# EAGLE design sega-genesis-forever (EAGLE 7.7.0)
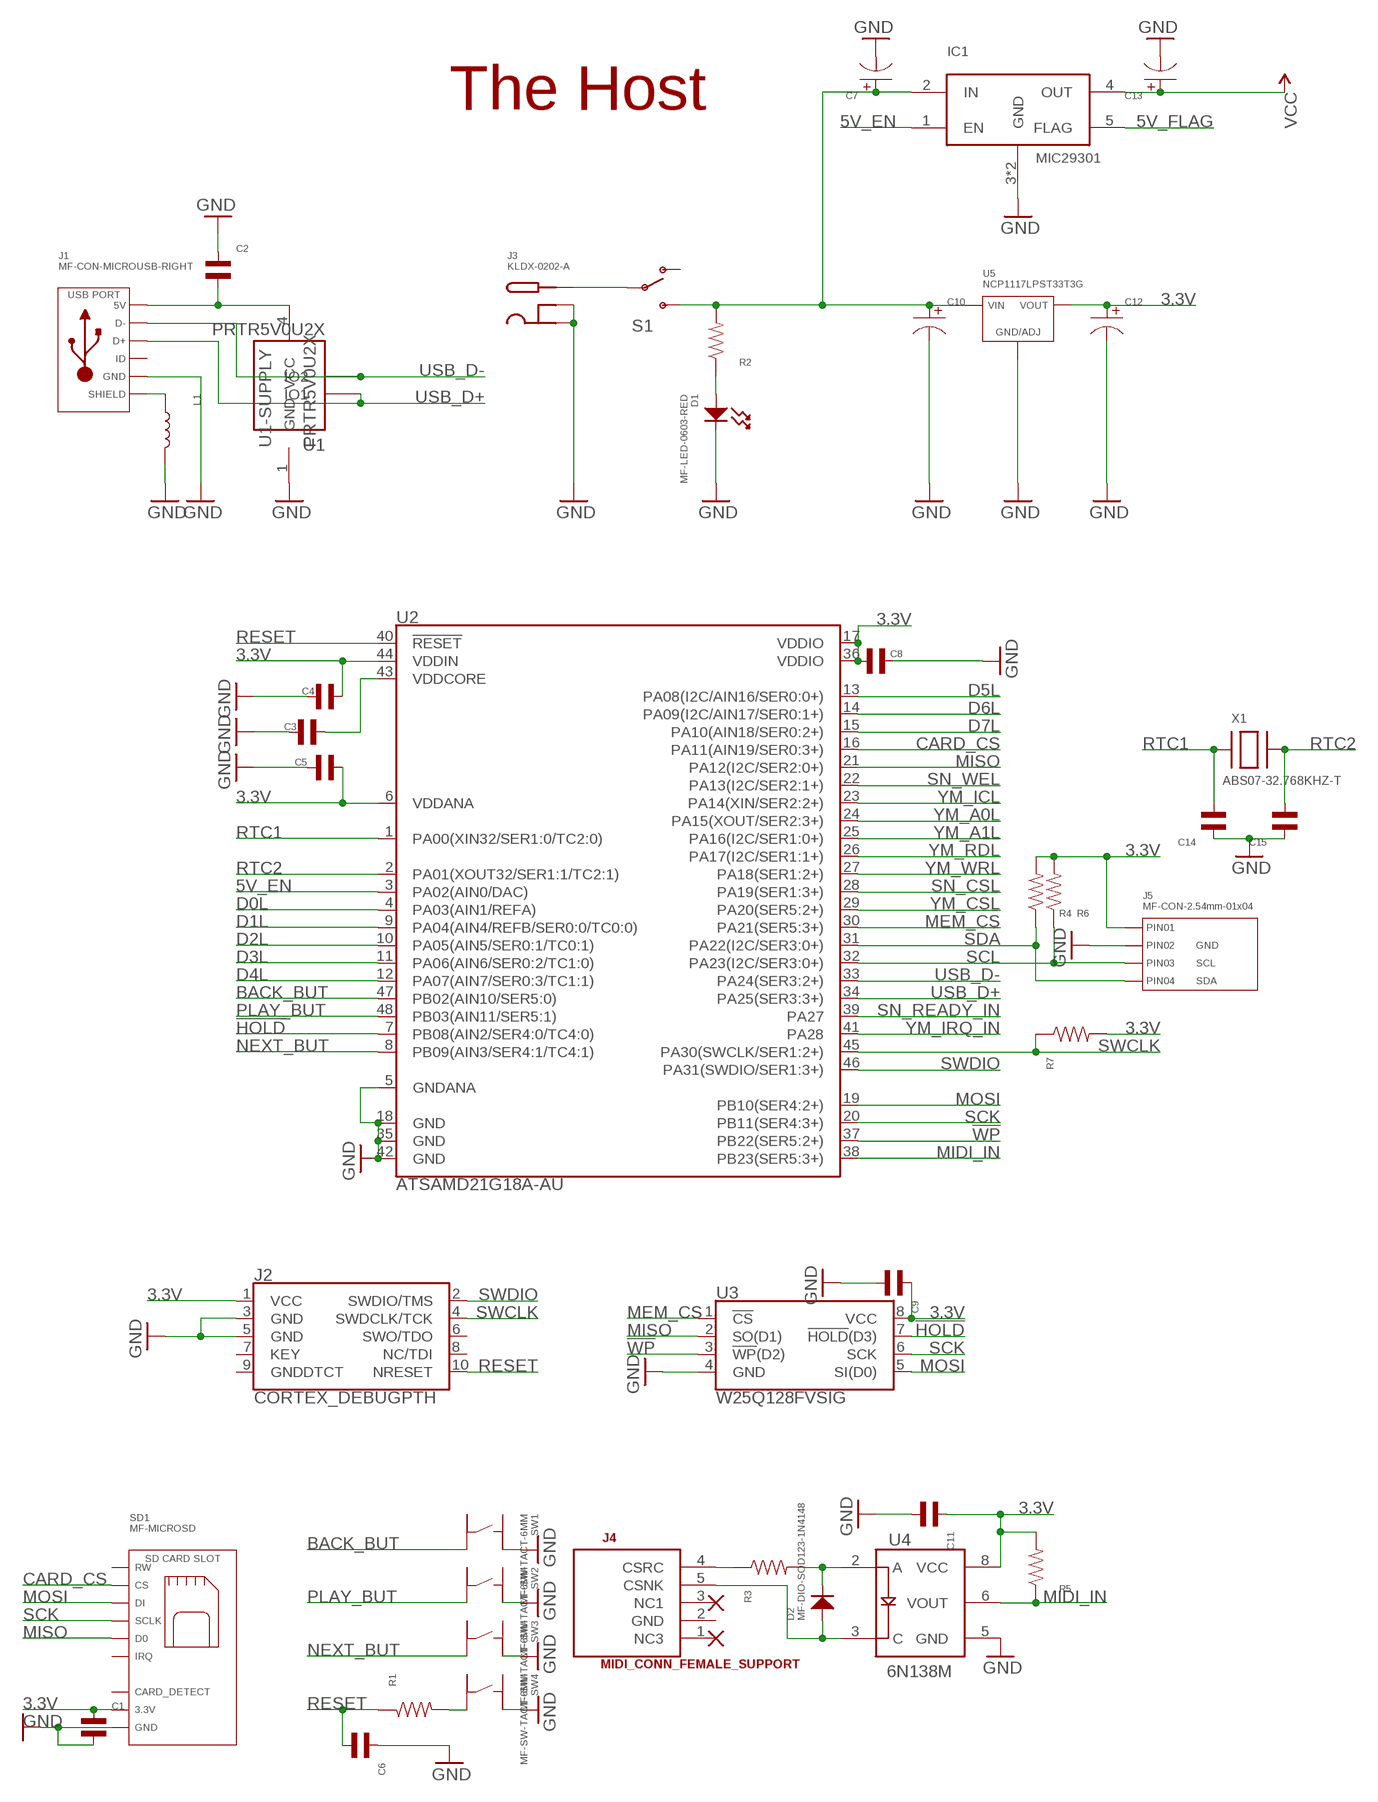
[diagram p0: schematic, sheet 1, part 1 of 2]
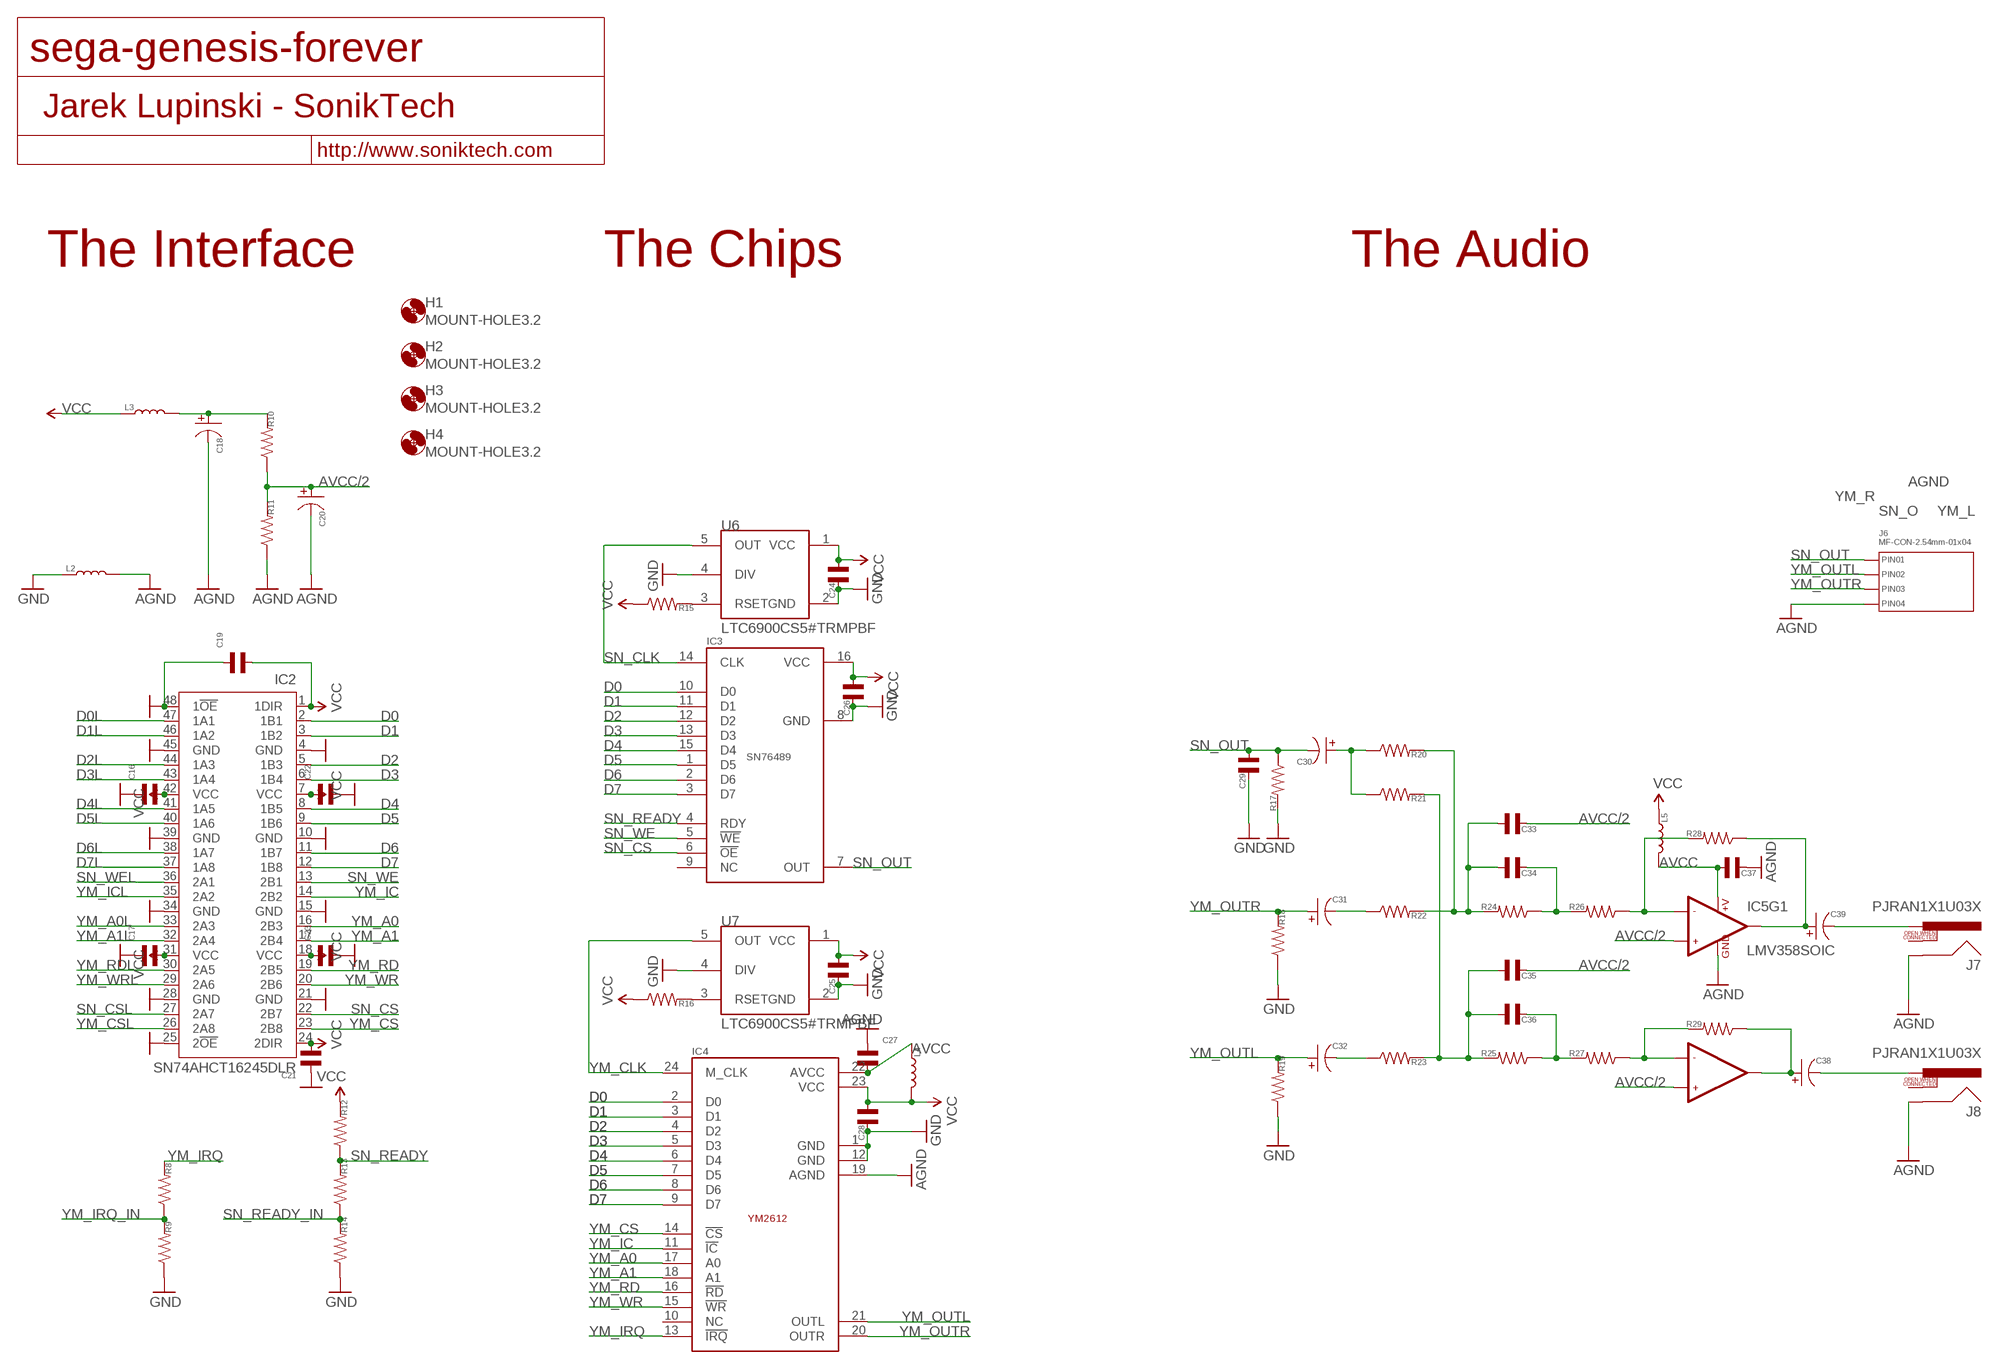
[diagram p1: schematic, sheet 1, part 2 of 2]

## Parts
C1  CAPACITOR_NP_0603  [C0603]
C2  CAPACITOR_NP_0603  [C0603]
C3  CAPACITOR_NP_0603  [C0603]
C4  CAPACITOR_NP_0603  [C0603]
C5  CAPACITOR_NP_0603  [C0603]
C6  CAPACITOR_NP_0603  [C0603]
C7  CAPACITOR_P_4MM  [CP4MM]
C8  CAPACITOR_NP_0603  [C0603]
C9  CAPACITOR_NP_0603  [C0603]
C10  CAPACITOR_P_4MM  [CP4MM]
C11  CAPACITOR_NP_0603  [C0603]
C12  CAPACITOR_P_4MM  [CP4MM]
C13  CAPACITOR_P_4MM  [CP4MM]
C14  CAPACITOR_NP_0603  [C0603]
C15  CAPACITOR_NP_0603  [C0603]
C16  CAPACITOR_NP_0603  [C0603]
C17  CAPACITOR_NP_0603  [C0603]
C18  CAPACITOR_P_4MM  [CP4MM]
C19  CAPACITOR_NP_0603  [C0603]
C20  CAPACITOR_P_6.3MM  [CP6.3MM]
C21  CAPACITOR_NP_0603  [C0603]
C22  CAPACITOR_NP_0603  [C0603]
C23  CAPACITOR_NP_0603  [C0603]
C24  CAPACITOR_NP_0603  [C0603]
C25  CAPACITOR_NP_0603  [C0603]
C26  CAPACITOR_NP_0603  [C0603]
C27  CAPACITOR_NP_0603  [C0603]
C28  CAPACITOR_NP_0603  [C0603]
C29  CAPACITOR_NP_0603  [C0603]
C30  CAPACITOR_P_4MM  [CP4MM]
C31  CAPACITOR_P_4MM  [CP4MM]
C32  CAPACITOR_P_4MM  [CP4MM]
C33  CAPACITOR_NP_0603  [C0603]
C34  CAPACITOR_NP_0603  [C0603]
C35  CAPACITOR_NP_0603  [C0603]
C36  CAPACITOR_NP_0603  [C0603]
C37  CAPACITOR_NP_0603  [C0603]
C38  CAPACITOR_P_4MM  [CP4MM]
C39  CAPACITOR_P_4MM  [CP4MM]
D1  MF-LED-0603-RED  LED_SINGLE-0603-RED  [LED0603]
D2  MF-DIO-SOD123-1N4148  DIODES_1N4148_SOD-123  [SOD-123]
H1  MOUNT-HOLE3.2  [3,2]
H2  MOUNT-HOLE3.2  [3,2]
H3  MOUNT-HOLE3.2  [3,2]
H4  MOUNT-HOLE3.2  [3,2]
IC1  MIC29301  [TO263-5]
IC2  SN74AHCT16245DLR  SN74LVCR162245A  [DL_R-PDSO-G48]
IC3  ED16DT  SN76489  [DIL16-EZ]
IC4  ED24DT  YM2612  [DIL24-EZ]
IC5  LMV358SOIC  [SO08]
J1  MF-CON-MICROUSB-RIGHT  USB_MICRO_RIGHT  [MICROUSB-RIGHT]
J2  CORTEX_DEBUGPTH  [2X5-PTH-1.27MM]
J3  KLDX-0202-A  DC_PWR_JACK_2.0MM_RIGHT  [DC_PWR_JACK]
J4  MIDI_CONN_FEMALE_SUPPORT  [DIN_5_FEMALE_SUPPORT]
J5  MF-CON-2.54mm-01x04  CON_01X04_PTH_2.54MM  [PTH_2.54MM_01X04]
J6  MF-CON-2.54mm-01x04  CON_01X04_PTH_2.54MM  [PTH_2.54MM_01X04]
J7  PJRAN1X1U03X  RCA  [RCA]
J8  PJRAN1X1U03X  RCA  [RCA]
L1  INDUCTOR_1210  [L1210]
L2  INDUCTOR_0603  [L0603]
L3  INDUCTOR_0603  [L0603]
L4  INDUCTOR_0603  [L0603]
L5  INDUCTOR_0603  [L0603]
R1  RESISTOR_0603  [R0603]
R2  RESISTOR_0603  [R0603]
R3  RESISTOR_0603  [R0603]
R4  RESISTOR_0603  [R0603]
R5  RESISTOR_0603  [R0603]
R6  RESISTOR_0603  [R0603]
R7  RESISTOR_0603  [R0603]
R8  RESISTOR_0603  [R0603]
R9  RESISTOR_0603  [R0603]
R10  RESISTOR_0603  [R0603]
R11  RESISTOR_0603  [R0603]
R12  RESISTOR_0603  [R0603]
R13  RESISTOR_0603  [R0603]
R14  RESISTOR_0603  [R0603]
R15  RESISTOR_0603  [R0603]
R16  RESISTOR_0603  [R0603]
R17  RESISTOR_0603  [R0603]
R18  RESISTOR_0603  [R0603]
R19  RESISTOR_0603  [R0603]
R20  RESISTOR_0603  [R0603]
R21  RESISTOR_0603  [R0603]
R22  RESISTOR_0603  [R0603]
R23  RESISTOR_0603  [R0603]
R24  RESISTOR_0603  [R0603]
R25  RESISTOR_0603  [R0603]
R26  RESISTOR_0603  [R0603]
R27  RESISTOR_0603  [R0603]
R28  RESISTOR_0603  [R0603]
R29  RESISTOR_0603  [R0603]
S1  SWITCH-SPDTPTH  [SWITCH-SPDT]
SD1  MF-MICROSD  SD_CARD_SLOT_MICRO_RIGHT  [MF-MICROSD]
SW1  MF-SW-TACT-6MM  TACT_6MM  [TACT6MM]
SW2  MF-SW-TACT-6MM  TACT_6MM  [TACT6MM]
SW3  MF-SW-TACT-6MM  TACT_6MM  [TACT6MM]
SW4  MF-SW-TACT-6MM  TACT_6MM  [TACT6MM]
U1  PRTR5V0U2X  [SOT-143B]
U2  ATSAMD21G18A-AU  ATSAMD21G-A  [TQFP-48]
U3  W25Q128FVSIG  W25Q32FVSS  [SOIC-8]
U4  6N138M  OPTO_DARL_6N138S  [8-SMD]
U5  NCP1117LPST33T3G  [SOT-223-3]
U6  LTC6900CS5#TRMPBF  LTC6900  [TSOT23-5L]
U7  LTC6900CS5#TRMPBF  LTC6900  [TSOT23-5L]
X1  ABS07-32.768KHZ-T  XTAL-3.2X1.5  [XTAL3215]

## Nets
3.3V: C1.P$1 C4.P$2 C5.P$2 C8.P$2 C9.P$1 C11.P$1 C12.P$1 J2.1(VCC) J5.P$1(PIN1) R4.P$2 R5.P$2 R6.P$2 R7.P$2 SD1.PIN4(3.3V) U2.6(VDDANA) U2.17(VDDIO) U2.36(VDDIO) U2.44(VDDIN) U3.8(VCC) U4.8(VCC) U5.P$1(VOUT) U5.P$3(VOUT)
5V_EN: IC1.1(EN) U2.3(PA02(AIN0/DAC))
5V_FLAG: IC1.5(FLAG)
!HOLD: U2.7(PB08(AIN2/SER4:0/TC4:0)) U3.7(!HOLD!(D3))
!WP: U2.37(PB22(SER5:2+)) U3.3(!WP!(D2))
AGND [Power]: C18.P$2 C20.P$2 C27.P$1 C37.P$2 IC4.19(AGND) IC5.4(GND) J6.P$4(PIN4) J7.SHELL J8.SHELL L2.P$2 R11.P$1
AVCC [Power]: C27.P$2 C37.P$1 IC4.22(AVCC) IC5.8(+V) L4.P$1 L5.P$2
AVCC/2 [Power]: C20.P$1 C33.P$2 C35.P$2 IC5.3(+IN1) IC5.5(+IN2) R10.P$1 R11.P$2
BACK_BUT: SW1.P$4 U2.47(PB02(AIN10/SER5:0))
CARD_CS: SD1.PIN2(CS) U2.16(PA11(AIN19/SER0:3+))
D0: IC2.2(1B1) IC3.10(D0) IC4.2(D0)
D0L: IC2.47(1A1) U2.4(PA03(AIN1/REFA))
D1: IC2.3(1B2) IC3.11(D1) IC4.3(D1)
D1L: IC2.46(1A2) U2.9(PA04(AIN4/REFB/SER0:0/TC0:0))
D2: IC2.5(1B3) IC3.12(D2) IC4.4(D2)
D2L: IC2.44(1A3) U2.10(PA05(AIN5/SER0:1/TC0:1))
D3: IC2.6(1B4) IC3.13(D3) IC4.5(D3)
D3L: IC2.43(1A4) U2.11(PA06(AIN6/SER0:2/TC1:0))
D4: IC2.8(1B5) IC3.15(D4) IC4.6(D4)
D4L: IC2.41(1A5) U2.12(PA07(AIN7/SER0:3/TC1:1))
D5: IC2.9(1B6) IC3.1(D5) IC4.7(D5)
D5L: IC2.40(1A6) U2.13(PA08(I2C/AIN16/SER0:0+))
D6: IC2.11(1B7) IC3.2(D6) IC4.8(D6)
D6L: IC2.38(1A7) U2.14(PA09(I2C/AIN17/SER0:1+))
D7: IC2.12(1B8) IC3.3(D7) IC4.9(D7)
D7L: IC2.37(1A8) U2.15(PA10(AIN18/SER0:2+))
GND [Power]: C1.P$2 C2.P$1 C3.P$2 C4.P$1 C5.P$1 C6.P$1 C7.P$2 C8.P$1 C9.P$2 C10.P$2 C11.P$2 C12.P$2 C13.P$2 C14.P$1 C15.P$1 C16.P$1 C17.P$1 C19.P$1 C21.P$1 C22.P$2 C23.P$2 C24.P$2 C25.P$2 C26.P$2 C28.P$2 C29.P$2 D1.CATHODE IC1.3(GND) IC1.6(GND) IC2.4(GND) IC2.10(GND) IC2.15(GND) IC2.21(GND) IC2.25(2!OE) IC2.28(GND) IC2.34(GND) IC2.39(GND) IC2.45(GND) IC2.48(1!OE) IC3.8(GND) IC4.1(GND) IC4.12(GND) J1.5(GND) J2.3(GND) J2.5(GND) J3.SLEEVE1(SLEEVE) J3.SLEEVE2(SLEEVE_SHUNT) J5.P$2(PIN2) L1.P$2 L2.P$1 R9.P$1 R14.P$1 R17.P$2 R18.P$1 R19.P$1 SD1.G0(GND) SD1.G1(GND) SD1.PIN6(GND) SW1.P$2 SW2.P$2 SW3.P$2 SW4.P$2 U1.1(GND) U2.5(GNDANA) U2.18(GND) U2.35(GND) U2.42(GND) U3.4(GND) U4.5(GND) U5.P$2(GND/ADJ) U6.2(GND) U6.4(DIV) U7.2(GND) U7.4(DIV)
LADC: IC5.6(-IN2) R27.P$1 R29.P$2
MEM_CS: U2.30(PA21(SER5:3+)) U3.1(!CS!)
MIDI_IN: R5.P$1 U2.38(PB23(SER5:3+)) U4.6(VOUT)
MISO: SD1.PIN7(D0) U2.21(PA12(I2C/SER2:0+)) U3.2(SO(D1))
MOSI: SD1.PIN3(DI) U2.19(PB10(SER4:2+)) U3.5(SI(D0))
N$1: C30.P$1 R20.P$1 R21.P$1
N$2: C31.P$2 R22.P$1
N$3: C32.P$2 R23.P$1
N$4: C33.P$1 C34.P$1 R20.P$2 R22.P$2 R24.P$2
N$5: C35.P$1 C36.P$1 R21.P$2 R23.P$2 R25.P$2
N$6: C39.P$1 IC5.1(OUT1) R28.P$1
N$7: J4.4(CSRC) R3.P$1
N$8: C3.P$1 U2.43(VDDCORE)
N$9: R1.P$2 SW4.P$4
N$10: J1.S1(SLD) J1.S2(SLD) J1.S3(SLD) J1.S4(SLD) J1.S5(SLD) J1.S6(SLD) L1.P$1
N$11: C38.P$1 IC5.7(OUT2) R29.P$1
N$12: C34.P$2 R24.P$1 R26.P$2
N$13: D2.CATHODE R3.P$2 U4.2(A)
N$14: D2.ANODE J4.5(CSNK) U4.3(C)
N$16: C39.P$2 J7.PIN
N$17: C36.P$2 R25.P$1 R27.P$2
N$18: D1.ANODE R2.P$1
N$19: C18.P$1 L3.P$2 R10.P$2
N$20: C38.P$2 J8.PIN
N$21 [Power]: C7.P$1 C10.P$1 IC1.2(IN) R2.P$2 S1.3(S) U5.P$4(VIN)
N$22 [Power]: J3.PIN S1.2(P)
N$23: R16.P$2 U7.3(RSET)
N$24: R15.P$2 U6.3(RSET)
N$25: C2.P$2 J1.1(5V) U1.4(VCC)
NEXT_BUT: SW3.P$4 U2.8(PB09(AIN3/SER4:1/TC4:1))
PLAY_BUT: SW2.P$4 U2.48(PB03(AIN11/SER5:1))
RADC: IC5.2(-IN1) R26.P$1 R28.P$2
RESET: C6.P$2 J2.10(NRESET) R1.P$1 U2.40(!RESET!)
RTC1: C14.P$2 U2.1(PA00(XIN32/SER1:0/TC2:0)) X1.P$1
RTC2: C15.P$2 U2.2(PA01(XOUT32/SER1:1/TC2:1)) X1.P$2
SCK: SD1.PIN5(SCLK) U2.20(PB11(SER4:3+)) U3.6(SCK)
SCL: J5.P$3(PIN3) R6.P$1 U2.32(PA23(I2C/SER3:0+))
SDA: J5.P$4(PIN4) R4.P$1 U2.31(PA22(I2C/SER3:0+))
SN_CLK: IC3.14(CLK) U6.5(OUT)
SN_CS: IC2.22(2B7) IC3.6(!OE)
SN_CSL: IC2.27(2A7) U2.28(PA19(SER1:3+))
SN_OUT: C29.P$1 C30.P$2 IC3.7(OUT) J6.P$1(PIN1) R17.P$1
SN_READY: IC3.4(RDY) R12.P$1 R13.P$2
SN_READY_IN: R13.P$1 R14.P$2 U2.39(PA27)
SN_WE: IC2.13(2B1) IC3.5(!WE)
SN_WEL: IC2.36(2A1) U2.22(PA13(I2C/SER2:1+))
SWCLK: J2.4(SWDCLK/TCK) R7.P$1 U2.45(PA30(SWCLK/SER1:2+))
SWDIO: J2.2(SWDIO/TMS) U2.46(PA31(SWDIO/SER1:3+))
USB_D+: J1.3(D+) U1.2(IO1) U2.34(PA25(SER3:3+))
USB_D-: J1.2(D-) U1.3(IO2) U2.33(PA24(SER3:2+))
VCC [Power]: C13.P$1 C16.P$2 C17.P$2 C19.P$2 C21.P$2 C22.P$1 C23.P$1 C24.P$1 C25.P$1 C26.P$1 C28.P$1 IC1.4(OUT) IC2.1(1DIR) IC2.7(VCC) IC2.18(VCC) IC2.24(2DIR) IC2.31(VCC) IC2.42(VCC) IC3.16(VCC) IC4.23(VCC) L3.P$1 L4.P$2 L5.P$1 R12.P$2 R15.P$1 R16.P$1 U6.1(VCC) U7.1(VCC)
YM_A0: IC2.16(2B3) IC4.17(A0)
YM_A0L: IC2.33(2A3) U2.24(PA15(XOUT/SER2:3+))
YM_A1: IC2.17(2B4) IC4.18(A1)
YM_A1L: IC2.32(2A4) U2.25(PA16(I2C/SER1:0+))
YM_CLK: IC4.24(M_CLK) U7.5(OUT)
YM_CS: IC2.23(2B8) IC4.14(!CS)
YM_CSL: IC2.26(2A8) U2.29(PA20(SER5:2+))
YM_IC: IC2.14(2B2) IC4.11(!IC)
YM_ICL: IC2.35(2A2) U2.23(PA14(XIN/SER2:2+))
YM_IRQ: IC4.13(!IRQ) R8.P$2
YM_IRQ_IN: R8.P$1 R9.P$2 U2.41(PA28)
YM_OUTL: C32.P$1 IC4.21(OUTL) J6.P$2(PIN2) R19.P$2
YM_OUTR: C31.P$1 IC4.20(OUTR) J6.P$3(PIN3) R18.P$2
YM_RD: IC2.19(2B5) IC4.16(!RD)
YM_RDL: IC2.30(2A5) U2.26(PA17(I2C/SER1:1+))
YM_WR: IC2.20(2B6) IC4.15(!WR)
YM_WRL: IC2.29(2A6) U2.27(PA18(SER1:2+))
Unconnected: IC3.9(NC) IC4.10(NC) J1.4(ID) J2.6(SWO/TDO) J2.7(KEY) J2.8(NC/TDI) J2.9(GNDDTCT) J4.1(NC3) J4.2(GND) J4.3(NC1) J7.SWITCH J8.SWITCH S1.1(O) SD1.PIN1(RW) SD1.PIN8(IRQ) SD1.PIN9(CRD_DTCT) SD1.PIN10(CRD_DTCT) SW1.P$1 SW1.P$3 SW2.P$1 SW2.P$3 SW3.P$1 SW3.P$3 SW4.P$1 SW4.P$3

## Notes on the sheet
- The Host
- The Interface | The Chips | The Audio

## Library data of the parts
C1-C6 C8 C9 C11 C14-C17 C19 C21-C29 C33-C37 = MF_Passives:CAPACITOR_NP: Library: MF_Passives Description: Device for Non-Polarized Capacitors. Manufacture part number (MPN) can be added via Attributes. Check https://factory.macrofab.com/parts for the house parts list.; POPULATE: 1
C7 C10 C12 C13 C18 C20 C30-C32 C38 C39 = MF_Passives:CAPACITOR_P: Library: MF_Passives Description: Device for Polarized Capacitors. Manufacture part number (MPN), Voltage Rating, and Tolerance can be added via Attributes. Check https://factory.macrofab.com/parts for the house parts list.; POPULATE: 1
D1 = MF_LEDs:LED_SINGLE: Library: MF_LEDs Description: Device for Single LED Packages. Manufacture part number (MFG#) can be added via Attributes.; HOUSEPART: YES; MPN: MF-LED-0603-RED; POPULATE: 1; URL: https://factory.macrofab.com/part/MF-LED-0603-RED
D2 = MF_Discrete_Semiconductor:DIODES: Library: MF_Discrete_Semiconductor Description: Device for Single Packaged Diodes.; HOUSEPART: YES; MPN: MF-DIO-SOD123-1N4148; POPULATE: 1; URL: https://factory.macrofab.com/part/MF-DIO-SOD123-1N4148
H1-H4 = holes:MOUNT-HOLE: MOUNTING HOLE with drill center marker
IC1 = sonik:MIC29301
IC2 = texas:SN74LVCR162245A: 16-BIT BUS TRANSCEIVER WITH 3-STATE OUTPUTS Auto generated by make-symbol-device-package-bsdl.ulp Rev. 33 Source: http://focus.ti.com/lit/ds/symlink/sn74lvcr162245.pdf; MPN: SN74LVCR162245DL; OC_FARNELL: 1739707; OC_NEWARK: 50R6613
IC3 = sonik:SN76489
IC4 = sonik:YM2612
IC5 = SparkFun-AnalogIC:LMV358: Jellybean rail-to-rail output op-amp; PROD_ID: IC-09657
J1 = MF_Connectors:USB: Library: MF_Connectors Description: 5 Pin USB Connectors. SLD is the shield connection. Usually tied to ground through a small ferrite bead.; HOUSEPART: YES; MPN: MF-CON-MICROUSB-RIGHT; POPULATE: 1; URL: https://factory.macrofab.com/part/MF-CON-MICROUSB-RIGHT
J2 = SparkFun-Connectors:CORTEX_DEBUG: Cortex Debug Connector Datasheet <http://infocenter.arm.com/help/topic/com.arm.doc.faqs/attached/13634/cortex_debug_connectors.pdf>
J3 = MF_Connectors:DC_PWR_JACK: Library: MF_Connectors Description: DC Barrel Power Jack Connector.; HOUSEPART: NO; MPN: KLDX-0202-A; POPULATE: 1; URL: http://www.4uconnector.com/online/object/4udrawing/18741.pdf
J4 = SparkFun-Connectors:MIDI_CONN_FEMALE_SUPPORT: MIDI connector with strain relief (DIN-5 female)
J5 = MF_Connectors:CON_01X04: Library: MF_Connectors Description: Header Connector with 04 Positions and 01 Rows. Use the LABEL Attribute to label the pin on the schematic and PCB. You can remove the attributes on the PCB by using the SMASH function on the part and then deleting the text.; HOUSEPART: YES; LABEL01: 3.3V; LABEL02: GND; LABEL03: SCL; LABEL04: SDA; MPN: MF-CON-2.54mm-01x04; POPULATE: 1; URL: https://factory.macrofab.com/part/MF-CON-2.54mm-01x04
J6 = MF_Connectors:CON_01X04: Library: MF_Connectors Description: Header Connector with 04 Positions and 01 Rows. Use the LABEL Attribute to label the pin on the schematic and PCB. You can remove the attributes on the PCB by using the SMASH function on the part and then deleting the text.; HOUSEPART: YES; LABEL01: SN_O; LABEL02: YM_L; LABEL03: YM_R; LABEL04: AGND; MPN: MF-CON-2.54mm-01x04; POPULATE: 1; URL: https://factory.macrofab.com/part/MF-CON-2.54mm-01x04
J7 J8 = SparkFun-Connectors:RCA
L1 = MF_Passives:INDUCTOR: Library: MF_Passives Description: Device for Inductors. Manufacture part number (MPN) can be added via Attributes. Check https://factory.macrofab.com/parts for the house parts list.
L2-L5 = MF_Passives:INDUCTOR: Library: MF_Passives Description: Device for Inductors. Manufacture part number (MPN) can be added via Attributes. Check https://factory.macrofab.com/parts for the house parts list.; POPULATE: 1
R1-R29 = MF_Passives:RESISTOR: Library: MF_Passives Description: Device for Resistors. Manufacture part number (MPN), Voltage, Tolerance, and Wattage Rating can be added via Attributes. Check https://factory.macrofab.com/parts for the house parts list.; POPULATE: 1
S1 = SparkFun-Electromechanical:SWITCH-SPDT: SPDT Switch Simple slide switch, Spark Fun Electronics SKU : COM-00102 DPDT SMT slide switch, AYZ0202, SWCH-08179; PROD_ID: SWCH-08261
SD1 = MF_Connectors:SD_CARD_SLOT: Library: MF_Connectors Description: SD Card Connector; HOUSEPART: YES; MPN: MF-MICROSD; POPULATE: 1; URL: https://factory.macrofab.com/part/MF-MICROSD
SW1-SW4 = MF_Switches:TACT: Library: MF_Switches Description: Device for Tact Switches. Manufacture part number (MFG#) can be added via Attributes.; HOUSEPART: YES; MPN: MF-SW-TACT-6MM; POPULATE: 1; URL: https://factory.macrofab.com/part/MF-SW-TACT-6MM
U1 = Volks73-NXPSemiconductors:PRTR5V0U2X?: I2C-Bus EDS Protection Ulta low capacitance double rail-to-rail ESD protection diode Documentation Datasheet <http://www.nxp.com/documents/data_sheet/PRTR5V0U2X.pdf> General Description Ultra low capacitance rail-to-rail ElectroStatic Discharge (ESD) protection diode in a small SOT143B Surface-Mounted Device (SMD) plastic package designed to protect two Hi-Speed data lines or high-frequency signal lines from the damage caused by ESD and other transients. PRTR5V0U2X incorporates two pairs of ultra low capacitance rail-to-rail diodes as well as an additional ESD protection diode to ensure signal line protection even if no supply voltage is available. Features ESD protection of two Hi-Speed data lines or high-frequency signal lines Ultra low input/output to ground capacitance: C(I/O-GND) = 1 pF ESD protection up to 8kV IEC 61000-4-2, level 4 (ESD) Very low clamping voltage due to an integrated additional ESD protection diode Very low reverse current Small SMD plastic package Applications USB 2.0 ports Digital Video Interface (DVI)/High Definition Multimedia Interface (HDMI) interfaces Mobile and cordless phones Personal Digital Assistants (PDA) Digital Cameras Wide Area Network (WAN) / Local Area Network (LAN) systems PCs, notebooks, printers, and other PC peripherals; APPLICATIONS: General Purpose; BIDIRECTIONAL_CHANNELS: 2; CAPACITANCE: 1pF @ 1MHz; CURRENT_PEAK_PULSE: -; DESCRIPTION: TVS DIODE 5.5VWM SOT143B; DOCUMENTATION_LINK: <a href="http://www.nxp.com/documents/data_sheet/PRTR5V0U2X.pdf">Datasheet</a>; DOCUMENTATION_URL: http://www.nxp.com/documents/data_sheet/PRTR5V0U2X.pdf; MANUFACTURER: NXP Semiconductors; MOUNTING_TYPE: Surface Mount; OPERATING_TEMPERATURE: -40C ~ 85C; PART_NUMBER: PRTR5V0U2X,215; POWER-PEAK_PULSE: -; POWER_LINE_PROTECTION: Yes; SUPPLIER_ITEM_LINK: <a href="http://www.digikey.com/product-detail/en/PRTR5V0U2X,215/568-4140-1-ND/1589981">Details</a>; SUPPLIER_ITEM_NUMBER: 568-4140-1-ND; SUPPLIER_ITEM_URL: http://www.digikey.com/product-detail/en/PRTR5V0U2X,215/568-4140-1-ND/1589981; SUPPLIER_LINK: <a href="http://www.digikey.com">Home Page</a>; SUPPLIER_NAME: Digi-Key; SUPPLIER_URL: http://www.digikey.com; TYPE: Steering (Rail to Rail); UNIDIRECTIONAL_CHANNELS: -; VOLTAGE_BREAKDOWN: 6V; VOLTAGE_CLAMPING: -; VOLTAGE_REVERSE: 5.5V
U2 = SparkFun-DigitalIC:ATSAMD21G: Atmel SAMD21G SMART ARM-Based Microcontroller The Atmel ® | SMART ™ SAM D21 is a series of low-power microcontrollers using the 32-bit ARM ® Cortex ® -M0+ processor, and ranging from 32- to 64-pins with up to 256KB Flash and 32KB of SRAM. The SAM D21 devices operate at a maximum frequency of 48MHz and reach 2.46 CoreMark/MHz. They are designed for simple and intuitive migration with identical peripheral modules, hex compatible code, identical linear address map and pin compatible migration paths between all devices in the product series. All devices include intelligent and flexible peripherals, Atmel Event System for inter-peripheral signaling, and support for capacitive touch button, slider and wheel user interfaces.; PROD_ID: IC-13064
U3 = SparkFun-DigitalIC:W25Q32FV: Winbond W25Q32FV 32Mbit (4MB) Flash The W25Q32FV support the standard Serial Peripheral Interface (SPI), Dual/Quad I/O SPI as well as 2-clocks instruction cycle Quad Peripheral Interface (QPI). Datasheet <http://www.winbond.com/resource-files/w25q32fv%20revh%20091613.pdf>; PROD_ID: IC-13229
U4 = SparkFun-DiscreteSemi:OPTO_DARL_6N138S: Optoisolator, darlington pair output; PROD_ID: IC-09482
U5 = MF_IC_Power:NCP1117LP: Manufacturer Part #: NCP1117LP Manufacturer: ON Semiconductor Description: LDO Voltage Regulators; HOUSEPART: NO; MPN: NCP1117LPST33T3G; POPULATE: 1; URL: http://www.onsemi.com/pub_link/Collateral/NCP1117LP-D.PDF
U6 U7 = sonikosc:LTC6900
X1 = adafruit:XTAL: Low cost SMT crystals, no capacitors included http://www.ladyada.net/library/eagle

## Net classes
1 Power: width 0.305 mm

## Board
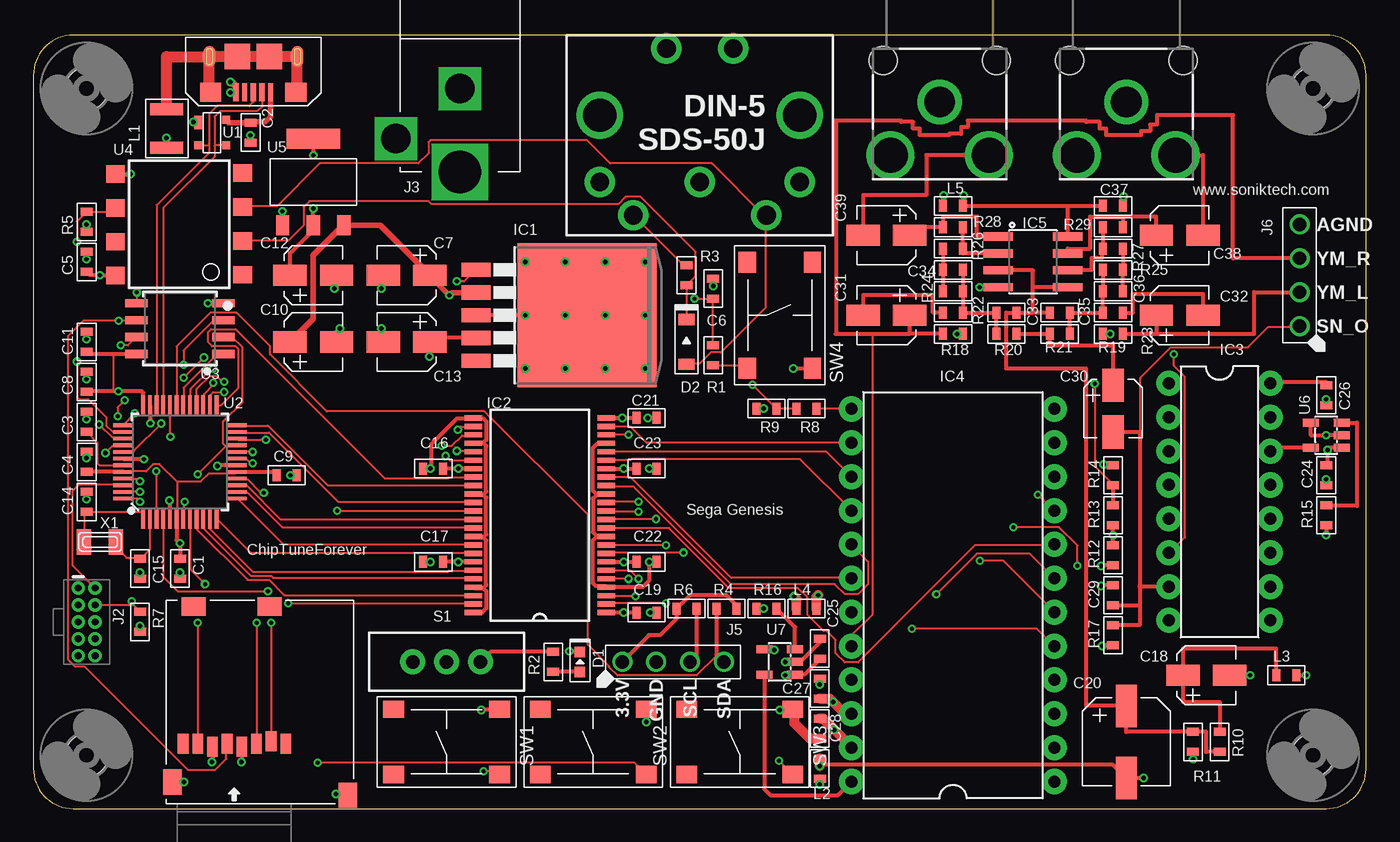
[diagram p2: board, top side]
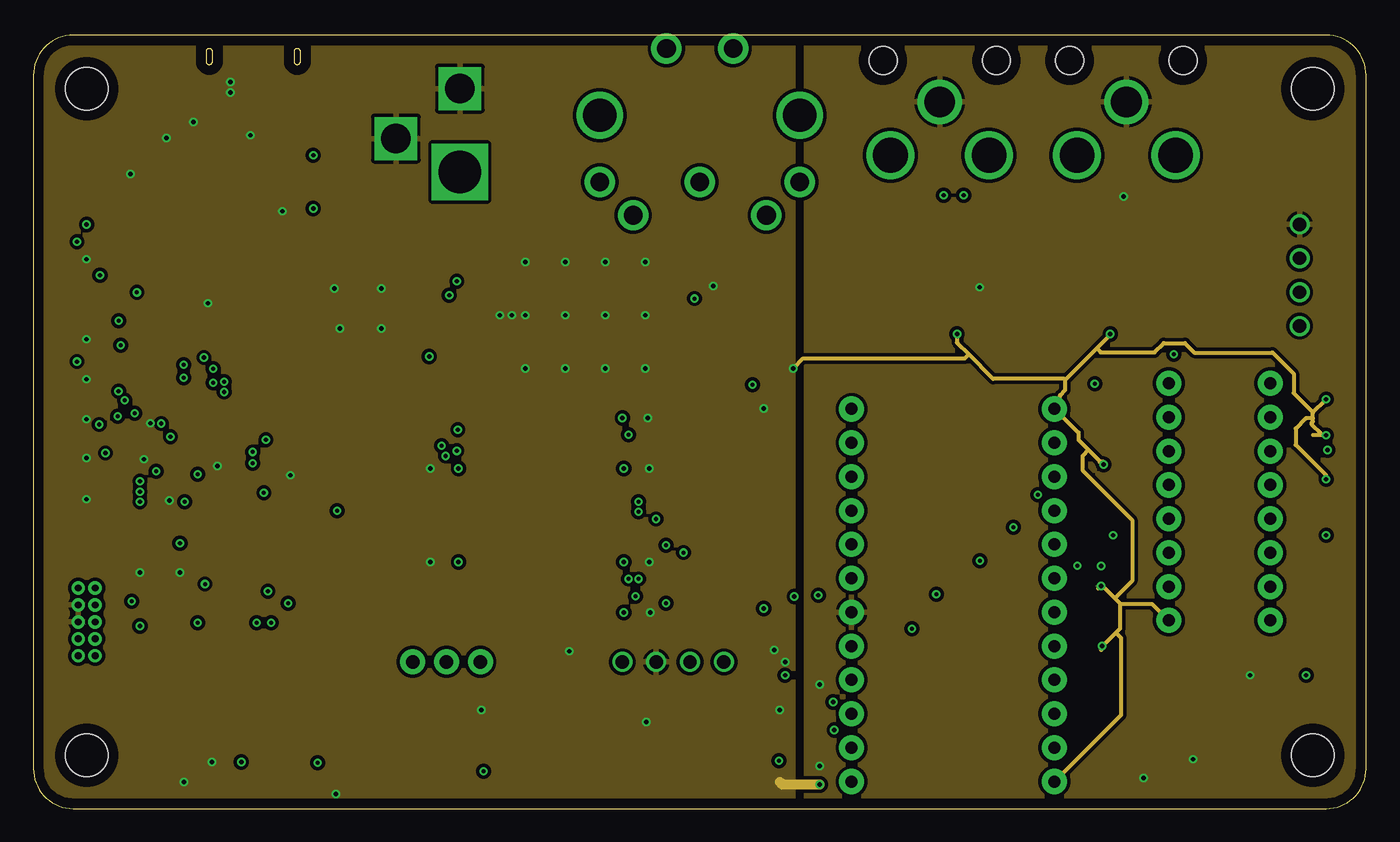
[diagram p3: board, inner layer GND]
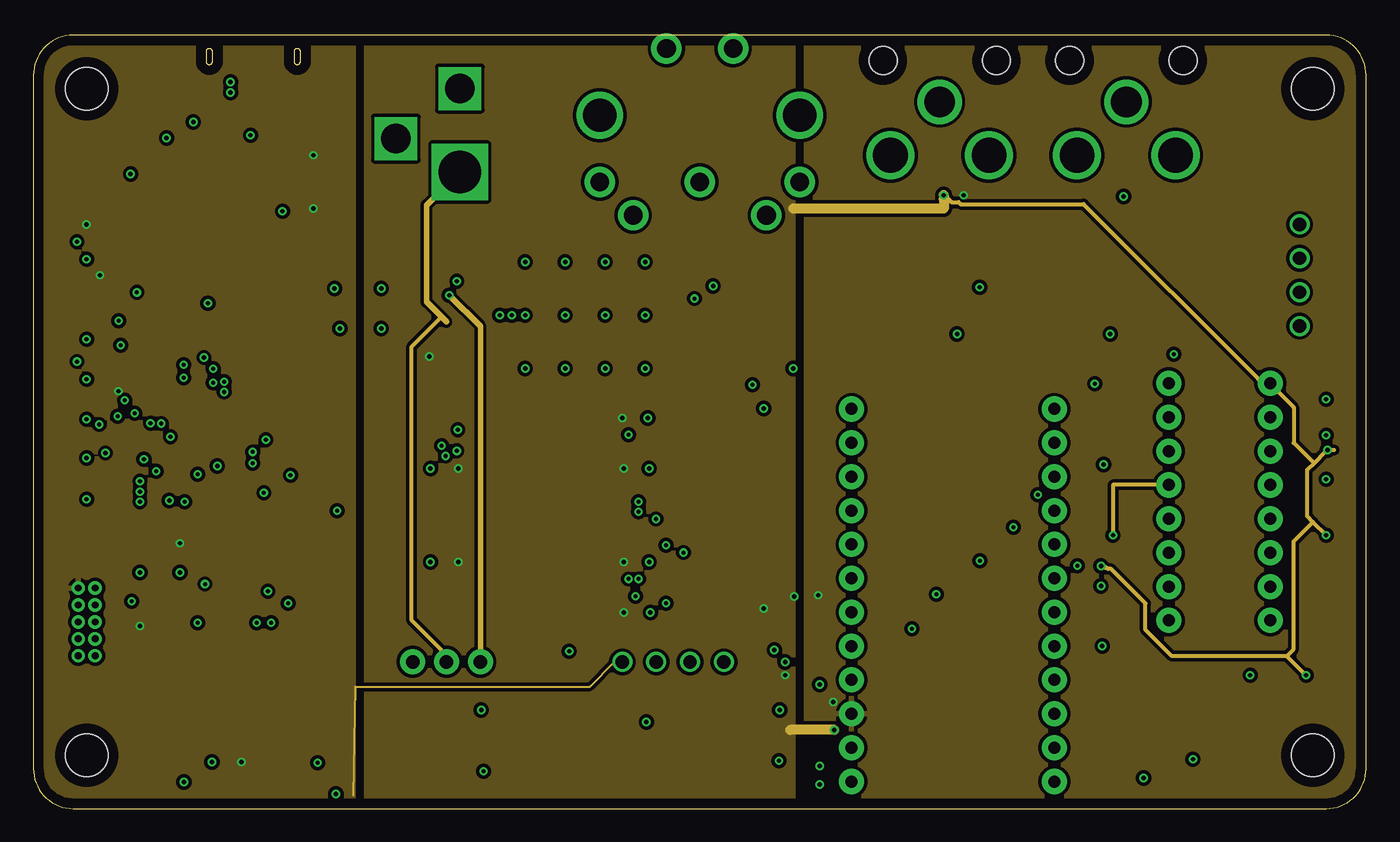
[diagram p4: board, inner layer PWR]
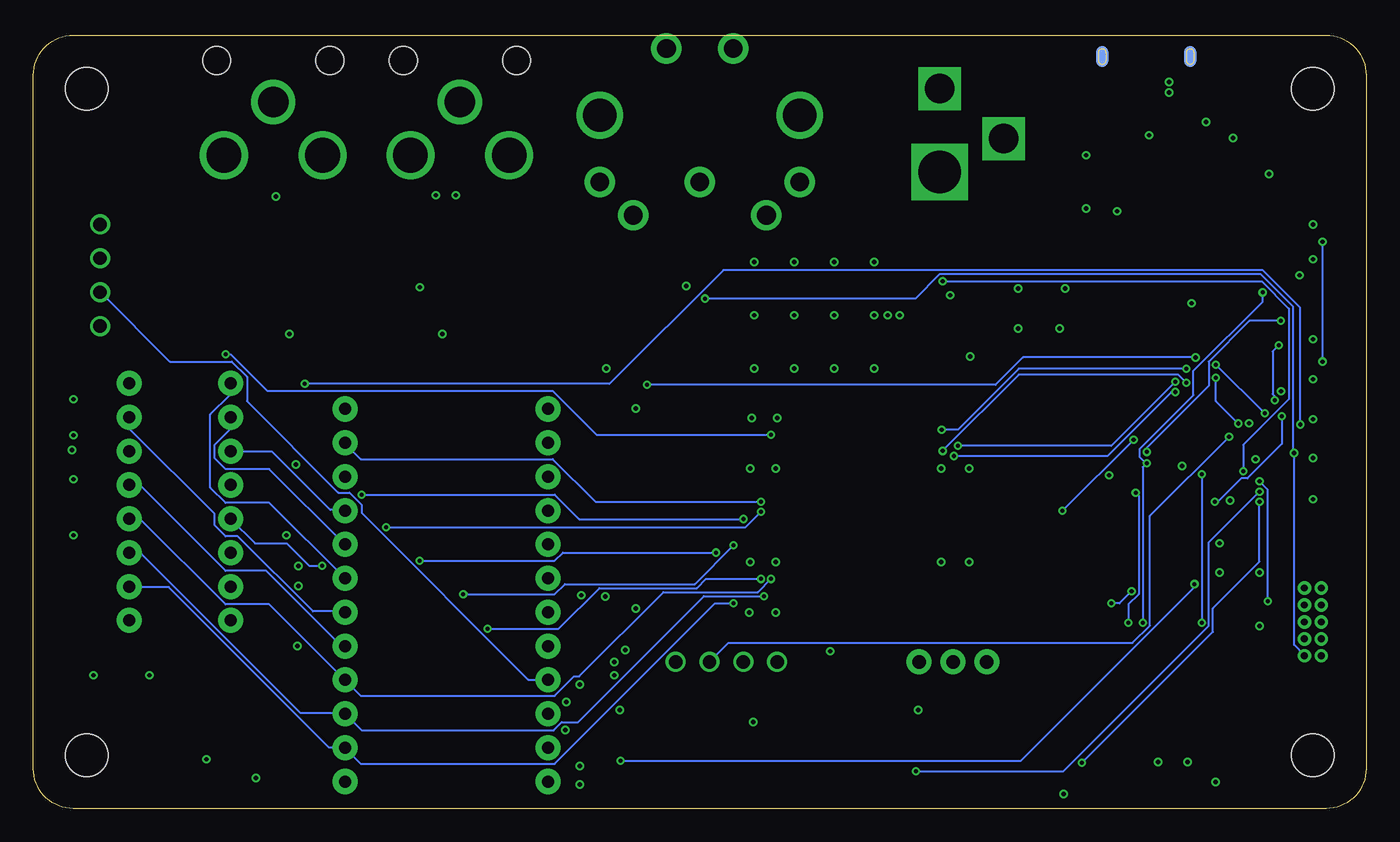
[diagram p5: board, bottom side, seen from below]

Size 100 x 58 mm. Coordinates in mm from the lower left corner, seen from the top.
Outline: 0,55 0,3 arc90 3,0 97,0 arc90 100,3 100,55 arc90 97,58 3,58 arc90 0,55
Copper layers (1*2*15*16): Top 0.035mm / dielectric 0.23mm / GND 0.035mm / dielectric 0.93mm / PWR 0.035mm / dielectric 0.23mm / Bottom 0.035mm
Design rules "MF_Standard_4_Layer *": minimum track width 6mil, minimum drill 12mil, track to track 6mil, track to pad 6mil, pad to pad 6mil, via to via 6mil, smd to smd 0mil, copper to edge 30mil, drill to drill 10mil, minimum pad ring 6mil, minimum via ring 6mil, stop-mask expansion 2mil, vias tented up to drill 25mil, thermal gap 10mil

### Footprints (pad centres in the part's own frame; a part is rotated, then mirrored left to right if it is on the bottom)
C0603 = smd 0.6 x 0.9: P$1 -0.75,0; P$2 0.75,0
CP4MM = smd 1.6 x 2.5: P$1 0,-1.75; P$2 0,1.75
CP6.3MM = smd 1.6 x 3.2: P$1 0,-2.7; P$2 0,2.7
LED0603 = smd 0.8 x 0.8: ANODE 0.75,0; CATHODE -0.75,0
SOD-123 = smd 0.85 x 1.2: ANODE 1.675,0; CATHODE -1.675,0
3,2 = hole 3.2: 0,0
TO263-5 = smd 1.067 x 2.159: 1 -3.404,-5.791; 2 -1.702,-5.791; 3 0,-5.791; 4 1.702,-5.791; 5 3.404,-5.791 | smd 10.8 x 10.41: 6 0,2.54
DL_R-PDSO-G48 = smd 1.3 x 0.4: 1 -4.98,7.303; 2 -4.98,6.668; 3 -4.98,6.032; 4 -4.98,5.397; 5 -4.98,4.763; 6 -4.98,4.128; 7 -4.98,3.493; 8 -4.98,2.857; 9 -4.98,2.223; 10 -4.98,1.587; 11 -4.98,0.953; 12 -4.98,0.318; 13 -4.98,-0.318; 14 -4.98,-0.953; 15 -4.98,-1.587; 16 -4.98,-2.223; 17 -4.98,-2.857; 18 -4.98,-3.493; 19 -4.98,-4.128; 20 -4.98,-4.763; 21 -4.98,-5.397; 22 -4.98,-6.032; 23 -4.98,-6.668; 24 -4.98,-7.303; 25 4.98,-7.303; 26 4.98,-6.668; 27 4.98,-6.032; 28 4.98,-5.397; 29 4.98,-4.763; 30 4.98,-4.128; 31 4.98,-3.493; 32 4.98,-2.857; 33 4.98,-2.223; 34 4.98,-1.587; 35 4.98,-0.953; 36 4.98,-0.318; 37 4.98,0.318; 38 4.98,0.953; 39 4.98,1.587; 40 4.98,2.223; 41 4.98,2.857; 42 4.98,3.493; 43 4.98,4.128; 44 4.98,4.763; 45 4.98,5.397; 46 4.98,6.032; 47 4.98,6.668; 48 4.98,7.303
DIL16-EZ = drill 0.9 pad 1.88: 1 -8.89,-3.795; 2 -6.35,-3.795; 3 -3.81,-3.795; 4 -1.27,-3.795; 5 1.27,-3.795; 6 3.81,-3.795; 7 6.35,-3.795; 8 8.89,-3.795; 9 8.89,3.795; 10 6.35,3.795; 11 3.81,3.795; 12 1.27,3.795; 13 -1.27,3.795; 14 -3.81,3.795; 15 -6.35,3.795; 16 -8.89,3.795
DIL24-EZ = drill 0.9 pad 1.88: 1 -13.97,-7.605; 2 -11.43,-7.605; 3 -8.89,-7.605; 4 -6.35,-7.605; 5 -3.81,-7.605; 6 -1.27,-7.605; 7 1.27,-7.605; 8 3.81,-7.605; 9 6.35,-7.605; 10 8.89,-7.605; 11 11.43,-7.605; 12 13.97,-7.605; 13 13.97,7.605; 14 11.43,7.605; 15 8.89,7.605; 16 6.35,7.605; 17 3.81,7.605; 18 1.27,7.605; 19 -1.27,7.605; 20 -3.81,7.605; 21 -6.35,7.605; 22 -8.89,7.605; 23 -11.43,7.605; 24 -13.97,7.605
SO08 = smd 0.61 x 2.21: 1 -1.905,-2.616; 2 -0.635,-2.616; 3 0.635,-2.616; 4 1.905,-2.616; 5 1.905,2.616; 6 0.635,2.616; 7 -0.635,2.616; 8 -1.905,2.616
MICROUSB-RIGHT = smd 0.4 x 1.35: 1 -1.3,1.27; 2 -0.65,1.27; 3 0,1.27; 4 0.65,1.27; 5 1.3,1.27 | smd 0.9 x 1.6: S1 -3.3,-1.4; S2 3.3,-1.4 | smd 1.6 x 1.4: S3 -3.2,1.27; S4 3.2,1.27 | smd 1.9 x 1.9: S5 -1.2,-1.405; S6 1.2,-1.405 | smd 0.9 x 1.6 bottom: S7 -3.3,-1.4; S8 3.3,-1.4
2X5-PTH-1.27MM = drill 0.508 pad 1: 1 -2.54,-0.635; 2 -2.54,0.635; 3 -1.27,-0.635; 4 -1.27,0.635; 5 0,-0.635; 6 0,0.635; 7 1.27,-0.635; 8 1.27,0.635; 9 2.54,-0.635; 10 2.54,0.635
DC_PWR_JACK = drill 3.2 square: PIN 6.25,0 | drill 2.2 square: SLEEVE1 0,0; SLEEVE2 3.75,-4.8
DIN_5_FEMALE_SUPPORT = drill 1.4 pad 2.286: 1 7.5,5; 2 0,5; 3 -7.5,5; 4 5,7.5; 5 -5,7.5; 6 -2.5,-5; 7 2.5,-5 | drill 2.5: P$1 -7.5,0; P$2 7.5,0
PTH_2.54MM_01X04 = drill 1: P$1 -3.81,0; P$2 -1.27,0; P$3 1.27,0; P$4 3.81,0
RCA = drill 2.6: PIN 4,3.7; SWITCH 4,-3.7 | drill 2.3: SHELL 0,0 | hole 2.1: -3.1,4.25; -3.1,-4.25
L1210 = smd 0.9 x 2.5: P$1 -1.45,0; P$2 1.45,0
L0603 = smd 0.6 x 0.9: P$1 -0.75,0; P$2 0.75,0
R0603 = smd 0.6 x 0.9: P$1 -0.75,0; P$2 0.75,0
SWITCH-SPDT = drill 1.016 pad 1.88: 1 0,2.54; 2 0,0; 3 0,-2.54
MF-MICROSD = smd 1.4 x 1.9: G0 -6.589,7.001; G1 6.561,6.001 | smd 0.8 x 1.5: PIN1 -1.939,3.151; PIN2 -0.839,2.951; PIN3 0.261,3.151; PIN4 1.361,3.351; PIN5 2.461,3.151; PIN6 3.561,3.351; PIN7 4.661,3.151; PIN8 5.761,3.151 | smd 1.8 x 1.4: PIN9 4.961,-7.149; PIN10 -0.739,-7.149
TACT6MM = smd 1.55 x 1.3: P$1 -3.975,2.45; P$2 3.975,2.45; P$3 -3.975,-2.45; P$4 3.975,-2.45
SOT-143B = smd 1 x 0.6: 1 -0.75,-1.05 | smd 0.6 x 0.6: 2 0.95,-1.05; 3 0.95,1.05; 4 -0.95,1.05
TQFP-48 = smd 1.5 x 0.28: 1 -4.25,2.75; 2 -4.25,2.25; 3 -4.25,1.75; 4 -4.25,1.25; 5 -4.25,0.75; 6 -4.25,0.25; 7 -4.25,-0.25; 8 -4.25,-0.75; 9 -4.25,-1.25; 10 -4.25,-1.75; 11 -4.25,-2.25; 12 -4.25,-2.75; 25 4.25,-2.75; 26 4.25,-2.25; 27 4.25,-1.75; 28 4.25,-1.25; 29 4.25,-0.75; 30 4.25,-0.25; 31 4.25,0.25; 32 4.25,0.75; 33 4.25,1.25; 34 4.25,1.75; 35 4.25,2.25; 36 4.25,2.75 | smd 0.28 x 1.5: 13 -2.75,-4.25; 14 -2.25,-4.25; 15 -1.75,-4.25; 16 -1.25,-4.25; 17 -0.75,-4.25; 18 -0.25,-4.25; 19 0.25,-4.25; 20 0.75,-4.25; 21 1.25,-4.25; 22 1.75,-4.25; 23 2.25,-4.25; 24 2.75,-4.25; 37 2.75,4.25; 38 2.25,4.25; 39 1.75,4.25; 40 1.25,4.25; 41 0.75,4.25; 42 0.25,4.25; 43 -0.25,4.25; 44 -0.75,4.25; 45 -1.25,4.25; 46 -1.75,4.25; 47 -2.25,4.25; 48 -2.75,4.25
SOIC-8 = smd 0.61 x 1.702: 1 -1.905,-3.251; 2 -0.635,-3.251; 3 0.635,-3.251; 4 1.905,-3.251; 5 1.905,3.251; 6 0.635,3.251; 7 -0.635,3.251; 8 -1.905,3.251
8-SMD = smd 1.3 x 1.4: 1 -3.96,-4.71; 2 -1.42,-4.71; 3 1.12,-4.71; 4 3.66,-4.71; 5 3.59,4.83; 6 1.05,4.83; 7 -1.49,4.83; 8 -4.03,4.83
SOT-223-3 = smd 1.5 x 4: P$1 3.25,0 | smd 1.5 x 1: P$2 -3.25,2.3; P$3 -3.25,0; P$4 -3.25,-2.3
TSOT23-5L = smd 0.6 x 1.2: 1 -0.95,-1.15; 2 0,-1.15; 3 0.95,-1.15; 4 0.95,1.15; 5 -0.95,1.15
XTAL3215 = smd 1.1 x 1.9: P$1 1.2,0; P$2 -1.2,0

### Placement (x,y rotation side)
C1  11,18 270 top
C2  16.3,50.7 90 top
C3  4,29 90 top
C4  4,26 270 top
C5  4,41 270 top
C6  51,39 270 top
C7  28,40 90 top
C8  4,32 270 top
C9  19,25 0 top
C10  21,35 270 top
C11  4,35 90 top
C12  21,40 270 top
C13  28,35 90 top
C14  4,23 270 top
C15  8,18 90 top
C16  30,25.5 0 top
C17  30,18.5 0 top
C18  88,10 270 top
C19  46,14.7 180 top
C20  82,5 180 top
C21  46,29.3 180 top
C22  46,18.5 0 top
C23  46,25.5 0 top
C24  97,25 270 top
C25  59,12 90 top
C26  97,31 270 top
C27  59,9 270 top
C28  59,6 270 top
C29  81,16 90 top
C30  81,30 180 top
C31  64,37 90 top
C32  86,37 270 top
C33  73,37.2 0 top
C34  69,40.4 180 top
C35  77,37.2 180 top
C36  81,38.8 0 top
C37  81,45.2 0 top
C38  86,43 270 top
C39  64,43 90 top
D1  41,11 270 top
D2  49,35 270 top
H1  4,4 0 top
H2  4,54 0 top
H3  96,4 0 top
H4  96,54 0 top
IC1  39,37 270 top
IC2  38,22 180 top
IC3  89,23 270 top
IC4  69,16 90 top
IC5  75,41 270 top
J1  16.5,55 180 top
J2  4,14 270 top
J3  32,54 270 top
J4  50,52 180 top
J5  48,11 0 top
J6  95,40 90 top
J7  68,53 270 top
J8  82,53 270 top
L1  10,51 270 top
L2  59,3 90 top
L3  94,10 180 top
L4  58,15 180 top
L5  69,45.2 0 top
R1  51,34 270 top
R2  39,11 90 top
R3  49,40 270 top
R4  52,15 0 top
R5  4,44 270 top
R6  49,15 180 top
R7  8,14 270 top
R8  58,30 0 top
R9  55,30 0 top
R10  89,5 90 top
R11  87,5 90 top
R12  81,19 270 top
R13  81,22 270 top
R14  81,25 270 top
R15  97,22 90 top
R16  55,15 0 top
R17  81,13 270 top
R18  69,35.6 180 top
R19  81,35.6 0 top
R20  73,35.6 180 top
R21  77,35.6 0 top
R22  69,37.2 0 top
R23  81,37.2 180 top
R24  69,38.8 0 top
R25  81,40.4 180 top
R26  69,42 180 top
R27  81,42 0 top
R28  69,43.6 0 top
R29  81,43.6 180 top
S1  31,11 90 top
SD1  17,8 180 top
SW1  31,5 0 top
SW2  42,5 0 top
SW3  53,5 0 top
SW4  56,37 270 top
U1  13.4,50.7 270 top
U2  11,26 90 top
U3  11,36 90 top
U4  11,44 90 top
U5  21,47 90 top
U6  97,28 90 top
U7  56,11 90 top
X1  5,20 180 top

### Tracks (layer width: path | path; a pad name or v marks a point on that pad's centre or on a via)
3.3V  (via drill 0.33)
  Top 0.152: 10.78,24.5 10.82,24.46 10.82,21.87 U2.6 | 10.78,24.5 9.45,25.83 8.99,25.83 8.46,25.3 6.86,25.3 U2.44 | U2.17 15.16,25.15 13.18,25.15 12.57,24.54 10.82,24.54 10.78,24.5 | 6.02,31.3 6.02,34.09
  Top 0.29: U2.36 8.25,31.15 | U2.17 18.25,25.25 | U2.6 10.75,20.15
  Top 0.305: U5.P$1 v21,49 | v21,45 U5.P$3 20.8,43.55 20.8,43.2 19.25,41.65 C12.P$1 | R5.P$2 v4,43.8 | U4.8 5.03,39.97 v5,40 4.25,40 C5.P$2 | C11.P$1 4.16,34.09 6.02,34.09 U3.8 | 8.25,31.15 8.1,31.3 v6.4,31.3 6.02,31.3 4.05,31.3 C8.P$2 | U2.44 C4.P$2 | 18.25,25.25 C9.P$1 | 10.75,20.15 v11,19.9 C1.P$1 | R7.P$2 v8,13.7 | SD1.PIN4 15.64,3.54 v15.6,3.5 | R4.P$2 52.75,15.25 52,16 49.25,16 R6.P$2 48.25,14.25 47,13 46.19,13 J5.P$1
  PWR 0.152: J5.P$1 44.12,10.97 43.59,10.97 41.76,9.14 24.16,9.14 24,0.96
  pour PWR (isolate 0.254): 0,58 24,58 24,0 0,0
5V_EN  (via drill 0.3)
  Top 0.152: v9.22,25.3 9.22,21.79 U2.3 | v31.77,39.55 32.31,39.55 33.15,40.39 IC1.1
  Bottom 0.152: v9.22,25.3 9.22,27.28 5.79,30.71 5.79,37.49 7.85,39.55 v31.77,39.55
!HOLD  (via drill 0.3)
  Top 0.152: v11.35,23.01 11.28,22.94 11.28,21.79 U2.7 | v6.33,29.41 6.33,30.1 v6.86,30.63 | v6.55,34.75 7.09,34.75 7.7,35.36 U3.7
  Bottom 0.152: v11.35,23.01 11.12,23.01 9.37,24.77 8.91,24.77 6.33,27.36 v6.33,29.41 | v6.86,30.63 6.86,30.94 7.01,31.09 7.01,34.29 v6.55,34.75
!WP  (via drill 0.3)
  Top 0.152: v7.62,29.64 6.78,28.8 U2.37 | v11.28,33.3 11.28,34.37 13.49,36.58 14.25,36.58 U3.3
  Bottom 0.152: v11.28,33.3 v7.62,29.64
AGND  (via drill 0.33)
  Top 0.305: v83.3,2.3 C20.P$2 81.92,2.36 81,3.28 59,3.28 | R11.P$1 v87,3.7 | C18.P$2 v91.3,10 | C37.P$2 81.75,45.9 v81.8,45.9 | IC5.4 v71,39.1 | 59,9.8 C27.P$1 v59,9.3
  Top 0.762: L2.P$2 59,3.28 v59,3.2
  pour GND (isolate 0.254): 58,58 100,58 100,0 58,0
AVCC  (via drill 0.33)
  Top 0.305: 77.62,45.2 L5.P$2 69.75,46 v69.8,46 | 77.62,45.2 C37.P$1 | IC5.8 77.62,45.2
  Top 0.762: C27.P$2 59.75,8.25 v60,8 60.8,7.2 61.3,7.2 IC4.22 | L4.P$1 58.75,15.85 v58.9,16
  pour PWR (isolate 0.254): 58,58 100,58 100,0 58,0
AVCC/2
  Top 0.305: IC5.5 75,39.09 | 75,39.09 75,40.37 IC5.3 | 75,37.2 C33.P$2 73,37.2 73,33 79,33 79,7.7 C20.P$1 82,5.75 R11.P$2 88,5.75 88,4.25 R10.P$1 | 75,37.2 75,39.09 | C35.P$2 75,37.2
BACK_BUT  (via drill 0.3)
  Top 0.152: v8,23.77 6.78,23.77 U2.47 | v33.78,2.8 34.7,2.8 34.9,2.59 SW1.P$4
  Bottom 0.152: v8,23.77 11.81,19.96 11.81,13.72 22.73,2.8 v33.78,2.8
CARD_CS  (via drill 0.3)
  Top 0.152: v17.83,13.95 17.83,5.11 SD1.PIN2 | v17.3,23.7 17.07,23.7 16.08,24.69 15.32,24.69 U2.16
  Bottom 0.152: v17.83,13.95 17.83,15.32 17.07,16.08 17.07,23.47 v17.3,23.7
D0  (via drill 0.3)
  Top 0.152: v47.47,15.39 43.05,15.39 IC2.2
  Bottom 0.152: v47.47,15.39 48.84,15.39 60.88,3.35 75.44,3.35 76.58,4.5 IC4.2 76.66,4.57 77.8,4.57 89.84,16.61 92.73,16.61 IC3.10
D0L  (via drill 0.3)
  Top 0.152: v19.13,15.39 32.99,15.39 IC2.47 | v17.6,16.31 10.82,16.31 9.75,17.37 9.75,21.72 U2.4
  Bottom 0.152: v19.13,15.39 18.52,15.39 v17.6,16.31
D1  (via drill 0.3)
  Top 0.152: v45.19,15.93 43.05,15.93 IC2.3
  Bottom 0.152: v45.19,15.93 49.68,15.93 59.13,6.48 60.35,6.48 60.96,5.87 75.36,5.87 76.58,7.09 IC4.3 76.66,7.16 79.93,7.16 91.9,19.13 92.73,19.13 IC3.11
D1L
  Top 0.152: IC2.46 32.99,16 18.82,16 17.68,17.14 16.08,17.14 12.27,20.95 12.27,21.72 U2.9
D2  (via drill 0.3)
  Top 0.152: v44.65,17.22 43.05,17.22 IC2.5
  Bottom 0.152: v44.65,17.22 45.64,16.23 52.73,16.23 59.05,9.91 59.44,9.91 60.88,8.46 75.44,8.46 76.58,9.6 IC4.4 76.66,9.68 82.3,15.32 85.57,15.32 91.97,21.72 92.73,21.72 IC3.12
D2L
  Top 0.152: IC2.44 32.99,17.3 17.98,17.3 17.83,17.45 16.31,17.45 12.8,20.95 12.8,21.72 U2.10
D3  (via drill 0.3)
  Top 0.152: v45.41,17.22 44.81,17.83 43.05,17.83 IC2.6 | v65.91,13.49 75.29,13.49 76.58,12.19 IC4.5
  Bottom 0.152: v45.41,17.22 49.53,17.22 50.22,16.54 57.53,16.54 60.58,13.49 v65.91,13.49 | IC3.13 92.73,24.23 91.97,24.23 85.57,17.83 82.53,17.83 76.89,12.19 76.66,12.19 IC4.5
D3L
  Top 0.152: IC2.43 32.99,17.83 31.17,17.83 31.09,17.75 16.46,17.75 13.26,20.95 13.26,21.72 U2.11
D4  (via drill 0.3)
  Top 0.152: v48.77,19.2 43.05,19.2 IC2.8 | v71.02,18.59 72.77,18.59 76.58,14.78 IC4.6
  Bottom 0.152: v48.77,19.2 60.27,19.2 60.88,18.59 v71.02,18.59 | IC3.15 92.73,29.34 92.73,28.42 86.41,22.1 86.41,21.26 85.57,20.42 84.66,20.42 79.02,14.78 76.66,14.78 IC4.6
D4L
  Top 0.152: IC2.41 32.99,19.2 16.31,19.2 13.79,21.72 U2.12
D5  (via drill 0.3)
  Top 0.152: v47.47,19.74 43.05,19.74 IC2.9 | v67.74,16.08 70.79,19.13 74.75,19.13 76.58,17.3 IC4.7
  Bottom 0.152: v47.47,19.74 50.37,16.84 60.12,16.84 60.88,16.08 v67.74,16.08 | IC3.1 85.27,31.85 85.27,31.01 86.72,29.57 86.72,24.08 85.57,22.94 82.3,22.94 76.66,17.3 IC4.7
D5L
  Top 0.152: IC2.40 32.99,19.81 18.75,19.81 15.32,23.24 U2.13
D6
  Top 0.152: IC2.11 43.05,21.03 47.7,21.03 52.2,16.54 57.38,16.54 58.06,15.85 58.06,14.55 59.28,13.34 59.51,13.34 60.2,12.65 60.2,11.66 60.88,10.97 61.87,10.97 70.64,19.74 76.58,19.74 IC4.8
  Bottom 0.152: IC3.2 85.27,29.34 85.27,28.42 86.41,27.28 86.41,26.29 85.57,25.45 82.3,25.45 76.66,19.81 IC4.8
D6L
  Top 0.152: IC2.38 32.99,21.11 18.67,21.11 16.08,23.7 15.32,23.7 U2.14
D7  (via drill 0.3)
  Top 0.152: v46.71,21.72 43.05,21.72 IC2.12 | v75.36,23.55 76.58,22.33 IC4.9
  Bottom 0.152: v46.71,21.72 59.05,21.72 60.88,23.55 v75.36,23.55 | IC3.3 85.19,26.75 82.07,26.75 77.72,22.4 76.66,22.4 IC4.9
D7L
  Top 0.152: IC2.37 32.99,21.72 18.52,21.72 16,24.23 15.32,24.23 U2.15
GND  (via drill 0.33)
  Top 0.29: U2.5 10.25,23.05 | U2.18 13.85,25.75 | U2.35 8.75,28.95
  Top 0.305: C2.P$1 v16.3,50.5 | L1.P$2 v10,50.3 | U4.5 v7.29,47.59 v7.3,47.6 | U5.P$2 v18.7,44.8 | D1.CATHODE 40.25,11.75 v40.2,11.8 | IC1.6 v35.9,37 v35,37 IC1.3 | C6.P$1 v51,39.2 | R9.P$1 v54.8,30 | C9.P$2 v19.3,25 | C16.P$1 v29.8,25.5 29.87,25.6 29.87,27.36 31.77,29.26 32.92,29.26 IC2.25 33.07,29.26 33.76,29.26 33.98,29.03 33.98,27.66 33.76,27.43 | C12.P$2 22.75,39.15 v22.6,39 | C7.P$2 26.25,39.15 v26.1,39 | C13.P$2 26.25,35.85 v26.1,36 | C10.P$2 22.75,35.75 v23,36 | C5.P$1 v4,41.2 | C11.P$2 v4,35.2 | U3.4 v13.1,37.9 | C8.P$1 v4,32.2 | C3.P$2 v4,29.2 | C4.P$1 v4,26.3 | C14.P$1 v4,23.2 | C1.P$2 v11,17.7 | C15.P$1 v8,17.7 | SD1.G1 v11.3,2 | SD1.PIN6 13.44,3.54 v13.4,3.5 | SD1.G0 22.7,1 v22.7,1.1 | 10.25,23.05 v10.2,23.1 | U2.42 8.25,26.25 v8.3,26.2 | 13.85,25.75 v13.8,25.7 | 8.75,28.95 v8.8,28.9 | C19.P$1 v46.3,14.7 | C22.P$2 v46.2,18.5 46.18,18.36 46.18,17.07 45.72,16.61 43.05,16.61 IC2.4 42.9,16.69 42.22,16.69 41.99,16.92 41.99,20.12 42.29,20.42 | C23.P$2 v46.2,25.5 | C21.P$1 v46.1,29.3 | C17.P$1 v29.8,18.5 | SW4.P$2 58.42,33 v57,33 | SW2.P$2 46,7.42 v46,6.5 | SW3.P$2 56.92,7.4 v56,7.4 | SW1.P$2 34.92,7.4 v33.6,7.4 | v56.4,11 U7.2 57.23,11.12 57.68,11.12 58.98,12.42 58.98,12.72 C25.P$2 | U7.4 54.9,11.9 v55.6,11.9 | C24.P$2 v97,24.7 | U6.2 v97,28 95.85,28 U6.4 | C26.P$2 v97,30.7 | R18.P$1 v69.3,35.6 | R19.P$1 v80.8,35.6 | R14.P$1 80.3,25.75 v80.3,25.8 | U1.1 12,51.45 v12,51.5 | C29.P$2 80.1,16.75 v80.1,16.7 | R17.P$2 80.2,12.25 v80.2,12.2 | 33.76,27.43 33.07,27.43 IC2.28 | 33.76,16.54 33.98,16.31 33.98,15.01 33.68,14.71 33.07,14.71 IC2.48 | 33.76,16.54 33.07,16.54 IC2.45 | 33.76,20.34 33.07,20.34 IC2.39 | 33.76,20.34 33.98,20.12 33.98,16.76 33.76,16.54
  Top 0.305: 33.76,23.55 33.07,23.55 IC2.34 | 33.76,23.55 33.98,23.32 33.98,20.57 33.76,20.34 | 33.76,27.43 33.98,27.2 33.98,23.77 33.76,23.55 | 42.29,20.42 42.98,20.42 IC2.10 | 42.29,20.42 41.99,20.73 41.99,23.24 42.29,23.55 | 42.29,23.55 42.98,23.55 IC2.15 | 42.29,23.55 41.99,23.85 41.99,27.05 42.29,27.36 42.98,27.36 IC2.21 | L2.P$1 59.05,2.21 59.05,1.83 v59,1.8
  Top 0.406: J1.5 15.2,53.7 | 15.2,53.7 15.2,53.3 | J1.5 15.2,54.2 14.9,54.5 v14.8,54.5 15.2,54.1 J1.5 | 15.2,53.7 v14.8,53.7
  Top 0.762: C28.P$2 58.25,5.25 57.1,6.4 57.1,7.33 SW3.P$2
  GND 0.305: v97,28 96.62,28 | 96.62,28 96,28 | v97,24.7 97,25 96.93,25.07 94.72,27.28 94.72,28.5 95.48,29.26 96.01,29.26 | v69.3,35.6 69.3,35 69.34,34.9 70.18,34.06 | v80.3,25.8 80.3,26 80,26 79.93,26.14 79.17,26.9 | 79.9,16.5 79.9,16.7 v80.1,16.7 80.24,16.69 81.15,15.77 | 80.1,11.9 80.1,12.2 v80.2,12.2 80.31,12.27 81.23,13.18 | 81.61,15.32 81.15,15.77 | 81.61,15.32 83.97,15.32 85.19,14.1 IC3.8 | 81.23,13.18 81.53,13.49 81.53,15.24 81.61,15.32 | 81.23,13.18 81.61,12.8 81.61,7.01 76.66,2.06 IC4.1 | 96.01,29.72 96.93,30.63 v97,30.7 | 96.01,29.26 96.01,29.03 95.94,28.96 95.94,28.8 96.62,28.12 96.62,28 | 96.01,29.26 96.01,29.72 | 77.42,32.16 79.78,34.52 | 79.78,34.52 80.77,35.51 80.77,35.59 v80.8,35.6 | 77.42,32.16 77.42,31.39 77.04,31.01 77.04,30.94 76.96,30.86 76.96,30.79 76.66,30.48 76.66,30.02 IC4.12 76.66,29.95 78.41,28.19 78.41,27.66 79.17,26.9 | 70.18,34.06 72.01,32.23 77.34,32.23 77.42,32.16 | 96.01,29.72 94.56,31.17 94.56,32.61 92.96,34.21 92.95,34.2 87.1,34.2 86.4,34.9 84.8,34.9 84.11,34.21 80.09,34.21 79.78,34.52 | 81.15,15.77 82.45,17.07 82.45,21.64 78.72,25.38 78.72,26.44 79.17,26.9 | 70.18,34.06 69.88,33.76 57.76,33.76 57.07,33.07 v57,33
  GND 0.762: v59,1.8 56.2,1.8 56,2
  other vias: 36.9,41 39.9,41 42.9,41 45.9,41 45.9,37 42.9,37 39.9,37 36.9,37 36.9,33 39.9,33 42.9,33 45.9,33
  pour GND (isolate 0.254): 0,58 57,58 57,0 0,0
LADC
  Top 0.305: R29.P$2 R27.P$1 80.2,42 80.2,41.3 79.4,41.3 79.4,40.4 77.62,40.4 IC5.6
MEM_CS
  Top 0.152: U2.30 11.28,30.25 11.28,31.55 13.79,34.06 14.25,34.06 U3.1
MIDI_IN  (via drill 0.3)
  Top 0.152: U4.6 5.87,44.75 R5.P$1 3.96,44.73 3.28,44.04 v3.28,42.52 | v3.28,33.53 3.28,30.86 3.43,30.71 4.12,30.71 5.49,29.34 5.49,28.73 5.94,28.27 6.71,28.27 U2.38
  Bottom 0.152: v3.28,42.52 v3.28,33.53
MISO  (via drill 0.3)
  Top 0.152: v12.34,13.95 12.34,4.88 SD1.PIN7 | 14.44,27.16 14.48,27.2 15.24,27.2 U2.21 | 14.44,27.16 v12.34,25.07 | 14.44,27.16 14.25,27.36 14.25,29.03 15.7,30.48 15.7,34.59 14.94,35.36 14.33,35.36 U3.2
  Bottom 0.152: v12.34,25.07 v12.34,13.95
MOSI  (via drill 0.3)
  Top 0.152: v16.76,13.95 16.76,4.88 SD1.PIN3 | v16.46,25.91 16.31,25.91 16,26.21 15.32,26.21 U2.19 | v7.77,38.71 7.77,37.95 U3.5
  Bottom 0.152: v16.76,13.95 16.76,25.6 v16.46,25.91 16.54,25.91 16.99,26.36 16.99,26.98 12.95,31.01 12.95,32.84 7.77,38.02 v7.77,38.71
N$1
  Top 0.305: R20.P$1 R21.P$1 76.25,34.75 81,34.75 C30.P$1
N$2
  Top 0.305: R22.P$1 67.5,37.2 67.5,38.5 62.25,38.5 C31.P$2
N$3
  Top 0.305: R23.P$1 82.5,37.2 82.5,38.6 87.75,38.6 C32.P$2
N$4
  Top 0.305: C34.P$1 R24.P$2 R22.P$2 C33.P$1 R20.P$2
N$5
  Top 0.305: R25.P$2 C36.P$1 R23.P$2 C35.P$1 R21.P$2
N$6
  Top 0.305: IC5.1 70.8,42.91 70.8,44.4 68.25,44.4 R28.P$1 65,43.6 65,43 C39.P$1
N$7
  Top 0.152: R3.P$1 49,40.77 48.77,40.77 45.03,44.5 J4.4
N$8
  Top 0.152: C3.P$1 4.8,27.45 4.8,25.9 4.95,25.75 U2.43
N$9
  Top 0.152: R1.P$2 53.33,33.25 SW4.P$4
N$10
  Top 0.813: J1.S4 13.2,53.73 J1.S2 | J1.S3 19.8,53.73 J1.S1 J1.S5 J1.S6 J1.S2 | L1.P$1 10,56.4 J1.S2
N$11
  Top 0.305: 81.75,44.4 79.3,44.4 79.3,42 77.62,42 IC5.7 | 81.75,44.4 R29.P$1 | C38.P$1 84.25,44.4 81.75,44.4
N$12
  Top 0.305: R26.P$2 C34.P$2 R24.P$1
N$13
  Top 0.152: D2.CATHODE R3.P$2 49.07,39.32 49.68,39.93 49.68,41.76 45.57,45.87 44.42,45.87 43.89,45.34 29.87,45.34 29.64,45.57 20.73,45.57 20.27,45.11 20.27,43.74 19.13,42.6 15.77,42.6 U4.2
N$14
  Top 0.152: D2.ANODE 49.07,33.38 49.99,33.38 50.83,34.21 51.59,34.21 54.94,37.57 54.94,44.42 J4.5 54.86,44.42 50.9,48.39 43.28,48.39 41.53,50.14 29.79,50.14 29.64,49.99 29.64,49.15 28.88,48.39 21.49,48.39 18.29,45.19 15.77,45.19 U4.3
N$16
  Top 0.305: J7.PIN 67,49 67,46 62.25,46 C39.P$2
N$17
  Top 0.305: R27.P$2 R25.P$1 C36.P$2
N$18
  Top 0.305: D1.ANODE R2.P$1
N$19
  Top 0.305: R10.P$2 89,8 86.25,8 C18.P$1 86.25,12 93.25,12 L3.P$2
N$20
  Top 0.305: J8.PIN 87.75,49 C38.P$2
N$21  (via drill 0.33)
  Top 0.305: R2.P$2 34.29,11.75 S1.3
  Top 0.406: IC1.2 31.4,38.7 v31.2,38.5 29.75,39.95 C7.P$1 26,43.75 U5.P$4 23.25,43.75 21,41.5 21,36.75 C10.P$1
  PWR 0.406: S1.3 33.54,36.16 v31.2,38.5
N$22
  PWR 0.305: 30.63,36.87 28.35,34.59 28.35,14.17 30.94,11.58 30.94,11.05 S1.2
  PWR 0.406: 31,36.5 30.63,36.87 29.5,38 29.5,45.25 J3.PIN
N$23
  Top 0.305: U7.3 57.15,13.6 R16.P$2
N$24
  Top 0.305: U6.3 99.3,28.95 99.3,22.7 97,22.7 R15.P$2
N$25
  Top 0.406: J1.1 17.8,51.9 17.4,51.5 16.35,51.5 C2.P$2 14.65,51.45 U1.4
NEXT_BUT  (via drill 0.3)
  Top 0.152: v12.88,16.84 11.81,17.91 11.81,21.72 U2.8 | v55.93,3.58 56.92,2.59 SW3.P$4
  Bottom 0.152: v12.88,16.84 12.88,16.61 25.91,3.58 v55.93,3.58
PLAY_BUT  (via drill 0.3)
  Top 0.152: v8,23.01 7.77,23.24 6.78,23.24 U2.48 | v21.34,3.43 45.11,3.43 45.95,2.59 SW2.P$4
  Bottom 0.152: v8,23.01 8,18.52 11.51,15.01 11.51,13.26 v21.34,3.43
RADC
  Top 0.305: IC5.2 69.75,41.63 R26.P$1 R28.P$2
RESET  (via drill 0.3)
  Top 0.152: R1.P$1 C6.P$2 50.98,38.25 v49.61,38.25 | v5.41,26.67 5.94,27.2 6.71,27.2 U2.40
  Bottom 0.152: J2.10 4.65,11.51 5.41,12.27 v5.41,26.67 5.49,26.75 5.49,37.64 7.92,40.08 32,40.08 33.83,38.25 v49.61,38.25
RTC1
  Top 0.152: U2.1 8.25,22.25 C14.P$2 3.8,22.25 X1.P$1
RTC2
  Top 0.152: X1.P$2 6.2,19.6 7,18.8 7.95,18.8 C15.P$2 8.15,18.9 8.2,18.9 8.75,19.45 U2.2
SCK  (via drill 0.3)
  Top 0.152: SD1.PIN5 14.48,4.8 14.48,3.73 13.64,2.9 11.58,2.9 3.81,10.67 3.12,10.67 2.59,11.2 2.59,35.43 3.73,36.58 v6.4,36.58 7.7,36.58 U3.6 | v16.46,26.75 15.32,26.75 U2.20
  Bottom 0.152: v16.46,26.75 16.46,27.05 11.81,31.7 11.81,33.53 8.76,36.58 v6.4,36.58
SCL  (via drill 0.3)
  Top 0.152: v10.29,27.89 10.29,30.18 U2.32
  Top 0.305: R6.P$1 49.75,11.48 J5.P$3
  Bottom 0.152: v10.29,27.89 16.23,21.95 16.23,13.72 17.53,12.42 47.85,12.42 49.23,11.05 J5.P$3
SDA
  Top 0.152: U2.31 10.74,34.67 13.26,37.19 15.24,37.19 17.75,34.67 17.75,34.06 22.02,29.79 33.83,29.79 41.6,22.02 41.6,12.27 43.2,10.67 43.2,10.59 43.81,9.98 49.76,9.98 51.21,11.43 J5.P$4
  Top 0.305: R4.P$1 51.25,11.56 J5.P$4
SN_CLK
  Top 0.305: U6.5 92.8,27.05 IC3.14
SN_CS  (via drill 0.3)
  Top 0.152: v44.65,28.04 43.05,28.04 IC2.22 | v85.57,34.06 85.57,33.22 86.41,32.38 86.41,20.34 85.27,19.2 IC3.6
  Bottom 0.152: v44.65,28.04 57.76,28.04 61.04,31.32 82.45,31.32 85.19,34.06 v85.57,34.06
SN_CSL  (via drill 0.3)
  Top 0.152: v30.63,27.2 31.39,27.2 32.16,27.96 32.99,27.96 IC2.27 | v14.33,32 14.17,32 13.72,32.46 13.26,32.46 12.27,31.47 12.27,30.25 U2.28
  Bottom 0.152: v30.63,27.2 19.13,27.2 v14.33,32
SN_OUT
  Top 0.152: J6.P$1 94.94,36.12 92.66,36.12 91.14,34.59 85.34,34.59 83.06,32.31 83.06,28.35 83,28.25
  Top 0.305: C30.P$2 83,28.25 83,16.65 | 83,16.65 83,15.25 | 83,15.25 83,13.75 R17.P$1 | C29.P$1 83,15.25 | IC3.7 83,16.65
SN_READY  (via drill 0.33)
  Top 0.305: R12.P$1 v81,20.5 R13.P$2
  PWR 0.305: IC3.4 81,24.27 v81,20.5
SN_READY_IN  (via drill 0.3)
  Top 0.152: v79.63,31.85 79.63,25.68 80.92,24.38 R14.P$2 | v4.95,28.8 5.94,27.81 6.71,27.81 U2.39
  Top 0.305: R14.P$2 R13.P$1
  Bottom 0.152: v79.63,31.85 56.77,31.85 48.23,40.39 7.77,40.39 4.95,37.57 v4.95,28.8
SN_WE  (via drill 0.3)
  Top 0.152: v45.41,22.25 43.05,22.25 IC2.13 | v73.53,21.11 76.96,21.11 78.33,19.74 v78.33,18.21
  Bottom 0.152: v45.41,22.25 46.56,21.11 v73.53,21.11 | v78.33,18.21 79.32,18.21 81,19.89 83.36,19.89 85.19,21.72 IC3.5
SN_WEL  (via drill 0.3)
  Top 0.152: v22.78,22.33 32.99,22.33 IC2.36 | v17.45,27.66 15.39,27.66 15.32,27.74 U2.22
  Bottom 0.152: v17.45,27.66 v22.78,22.33
SWCLK  (via drill 0.3)
  Top 0.152: J2.4 7.39,15.27 | 7.39,15.27 7.48,15.27 R7.P$1 | v8,24.54 7.85,24.69 6.78,24.69 U2.45 | 7.39,15.27 v7.39,15.54
  Bottom 0.152: v8,24.54 7.39,23.93 v7.39,15.54
SWDIO
  Top 0.152: U2.46 6.71,24.31 3.43,24.31 2.97,23.85 2.97,18.21 4.57,16.61 J2.2
USB_D+
  Top 0.152: J1.3 16.5,53 16.2,52.7 13.8,52.7 13.2,52.1 13.2,49.9 | 13.2,49.9 13.2,49.2 9.25,45.25 U2.34 | U1.2 13.15,49.75 13.2,49.9
USB_D-
  Top 0.152: J1.2 17.15,52.65 16.8,52.3 14,52.3 13.6,51.9 13.6,49.7 | 13.6,49.7 13.6,48.9 9.75,45.05 U2.33 | U1.3 13.65,49.75 13.6,49.7
VCC  (via drill 0.33)
  Top 0.305: IC1.4 30.05,35.3 C13.P$1 29.75,33.95 v29.7,33.9 | IC2.42 v31.9,18.5 C17.P$2 | IC2.31 v31.9,25.5 C16.P$2 | IC2.24 v44.2,29.3 C21.P$2 | IC2.18 v44.3,25.5 C23.P$1 | IC2.7 v44.3,18.5 C22.P$1 | R16.P$1 v54.8,15 | C19.P$2 v44.3,14.7 IC2.1 | C25.P$1 59,11.2 57.85,10.05 U7.1 57.1,10 v56.4,10 | U6.1 97,27.05 97,26.9 v97.1,26.9 | L3.P$1 v95.5,10 | R15.P$1 v97,20.5 | 97.2,26.9 v97.1,26.9 | L5.P$1 68.25,46 v68.3,46 | C24.P$1 97.1,25.75 v97.1,26.9 | IC3.16 92.91,32 97,32 C26.P$1 | R12.P$2 80.1,18.25 v80.1,18.2
  Top 0.762: IC4.23 61.4,4.61 v60.1,5.9 59.25,6.75 C28.P$1 | L4.P$2 57.25,15.75 v57.1,15.9
  PWR 0.305: 97.6,26.9 v97.1,26.9 97.16,26.82 97.08,26.75 96.93,26.75 96.09,25.91 | 96.01,21.49 95.56,21.95 95.56,25.38 96.09,25.91 | 96.01,21.49 96.93,20.57 v97,20.5 | 96.09,25.91 94.56,27.43 94.56,30.1 92.81,31.85 IC3.16 92.66,31.93 92.28,31.93 91.97,32.23 91.9,32.23 78.79,45.34 69.57,45.34 69.42,45.49 68.89,45.49 68.66,45.72 68.3,45.72 | 94.03,11.43 85.42,11.43 83.44,13.41 83.44,15.39 80.85,17.98 80.62,17.98 80.54,18.06 80.47,18.06 80.31,18.21 80.24,18.21 v80.1,18.2 | 94.03,11.43 95.33,10.13 95.48,10.13 v95.5,10 | 96.01,21.49 94.56,20.04 94.56,11.96 94.03,11.43
  PWR 0.762: v60.1,5.9 56.8,5.9 | v68.3,46 68.3,45.72 68.3,45 57,45
  pour PWR (isolate 0.254): 25,58 57,58 57,0 25,0
YM_A0
  Top 0.152: IC2.16 43.05,24.16 45.03,24.16 52.35,16.84 60.12,16.84 60.88,16.08 61.87,16.08 62.64,16.84 62.64,18.52 61.42,19.74 IC4.17
YM_A0L
  Top 0.152: IC2.33 32.99,24.23 22.1,24.23 17.6,28.73 15.32,28.73 U2.24
YM_A1
  Top 0.152: IC2.17 43.05,24.84 44.81,24.84 52.35,17.3 61.34,17.3 IC4.18
YM_A1L
  Top 0.152: IC2.32 32.99,24.84 31.17,24.84 31.09,24.77 26.36,24.77 15.16,35.97 13.34,35.97 13.11,35.74 13.11,34.98 13.41,34.67 15.16,34.67 15.39,34.44 15.39,31.55 14.1,30.25 13.79,30.25 U2.25
YM_CLK
  Top 0.305: U7.5 54.85,1.45 55.3,1 60.37,1 IC4.24
YM_CS
  Top 0.152: IC2.23 43.05,28.65 44.81,28.65 46.02,27.43 61.34,27.43 IC4.14
YM_CSL  (via drill 0.3)
  Top 0.152: v31.85,28.42 32.08,28.65 32.99,28.65 IC2.26 | v13.49,32.99 13.34,32.99 11.81,31.47 11.81,30.25 U2.29
  Bottom 0.152: v31.85,28.42 30.63,28.42 26.06,32.99 v13.49,32.99
YM_IC  (via drill 0.3)
  Top 0.152: v45.41,23.01 43.05,23.01 IC2.14
  Bottom 0.152: v45.41,23.01 57.84,23.01 61.04,26.21 75.44,26.21 76.58,27.36 IC4.11
YM_ICL
  Top 0.152: IC2.35 32.99,23.01 22.86,23.01 17.68,28.19 15.32,28.19 U2.23
YM_IRQ
  Top 0.152: IC4.13 58.78,29.97 R8.P$2
YM_IRQ_IN  (via drill 0.3)
  Top 0.152: R8.P$1 R9.P$2 55.7,30.02 v53.95,31.77 | v11.28,32.31 v12.8,33.83 | v9.6,28.88 7.54,26.82 6.78,26.82 U2.41
  Bottom 0.152: v53.95,31.77 27.81,31.77 25.76,33.83 v12.8,33.83 | v11.28,32.31 11.28,30.56 v9.6,28.88
YM_OUTL
  Top 0.305: R19.P$2 84.25,35.6 | C32.P$1 84.25,35.6 | 84.25,35.6 91.6,35.6 91.6,38.73 J6.P$2
  Bottom 0.152: IC4.21 61.42,9.68 62.87,9.68 75.36,22.17 75.36,22.78 76.28,23.7 77.11,23.7 83.97,30.56 83.97,32.38 85.11,33.53 89.76,33.53 94.94,38.71 J6.P$2
YM_OUTR
  Top 0.152: 62.94,35.6 62.94,14.55 61.42,13.03 61.42,12.19 IC4.20
  Top 0.305: R18.P$2 65.75,35.6 | 65.75,35.6 C31.P$1 | J6.P$3 90,41.27 90,52 84.3,52 84.3,51.3 83.8,51.3 83.8,50.8 83.1,50.8 83.1,50.5 80.5,50.5 80.5,51 80,51 80,51.5 79,51.5 79,51.6 70.1,51.6 70.1,51.1 69.6,51.1 69.6,50.6 68.7,50.6 68.7,50.5 66.5,50.5 66.5,51 66,51 66,51.5 65.1,51.5 65.1,51.6 60.2,51.6 60.2,35.6 62.94,35.6 65.75,35.6
YM_RD
  Top 0.152: IC2.19 43.05,26.14 44.81,26.14 44.88,26.21 57.53,26.21 61.34,22.4 IC4.16
YM_RDL  (via drill 0.3)
  Top 0.152: v30.94,26.44 31.24,26.14 32.99,26.14 IC2.30 | v14.33,31.24 13.49,31.24 13.26,31.01 U2.26
  Bottom 0.152: v30.94,26.44 19.43,26.44 14.63,31.24 v14.33,31.24
YM_WR
  Top 0.152: IC2.20 43.05,26.75 59.51,26.75 61.34,24.92 IC4.15
YM_WRL  (via drill 0.3)
  Top 0.152: v31.77,26.82 32.99,26.82 IC2.29 | v13.49,31.93 13.49,31.77 12.8,31.09 12.8,30.25 U2.27
  Bottom 0.152: v31.77,26.82 26.06,32.54 14.1,32.54 v13.49,31.93

### Text on the board
tNames: www.soniktech.com | Sega Genesis | ChipTuneForever